# Altium project SIBB.PrjPcb
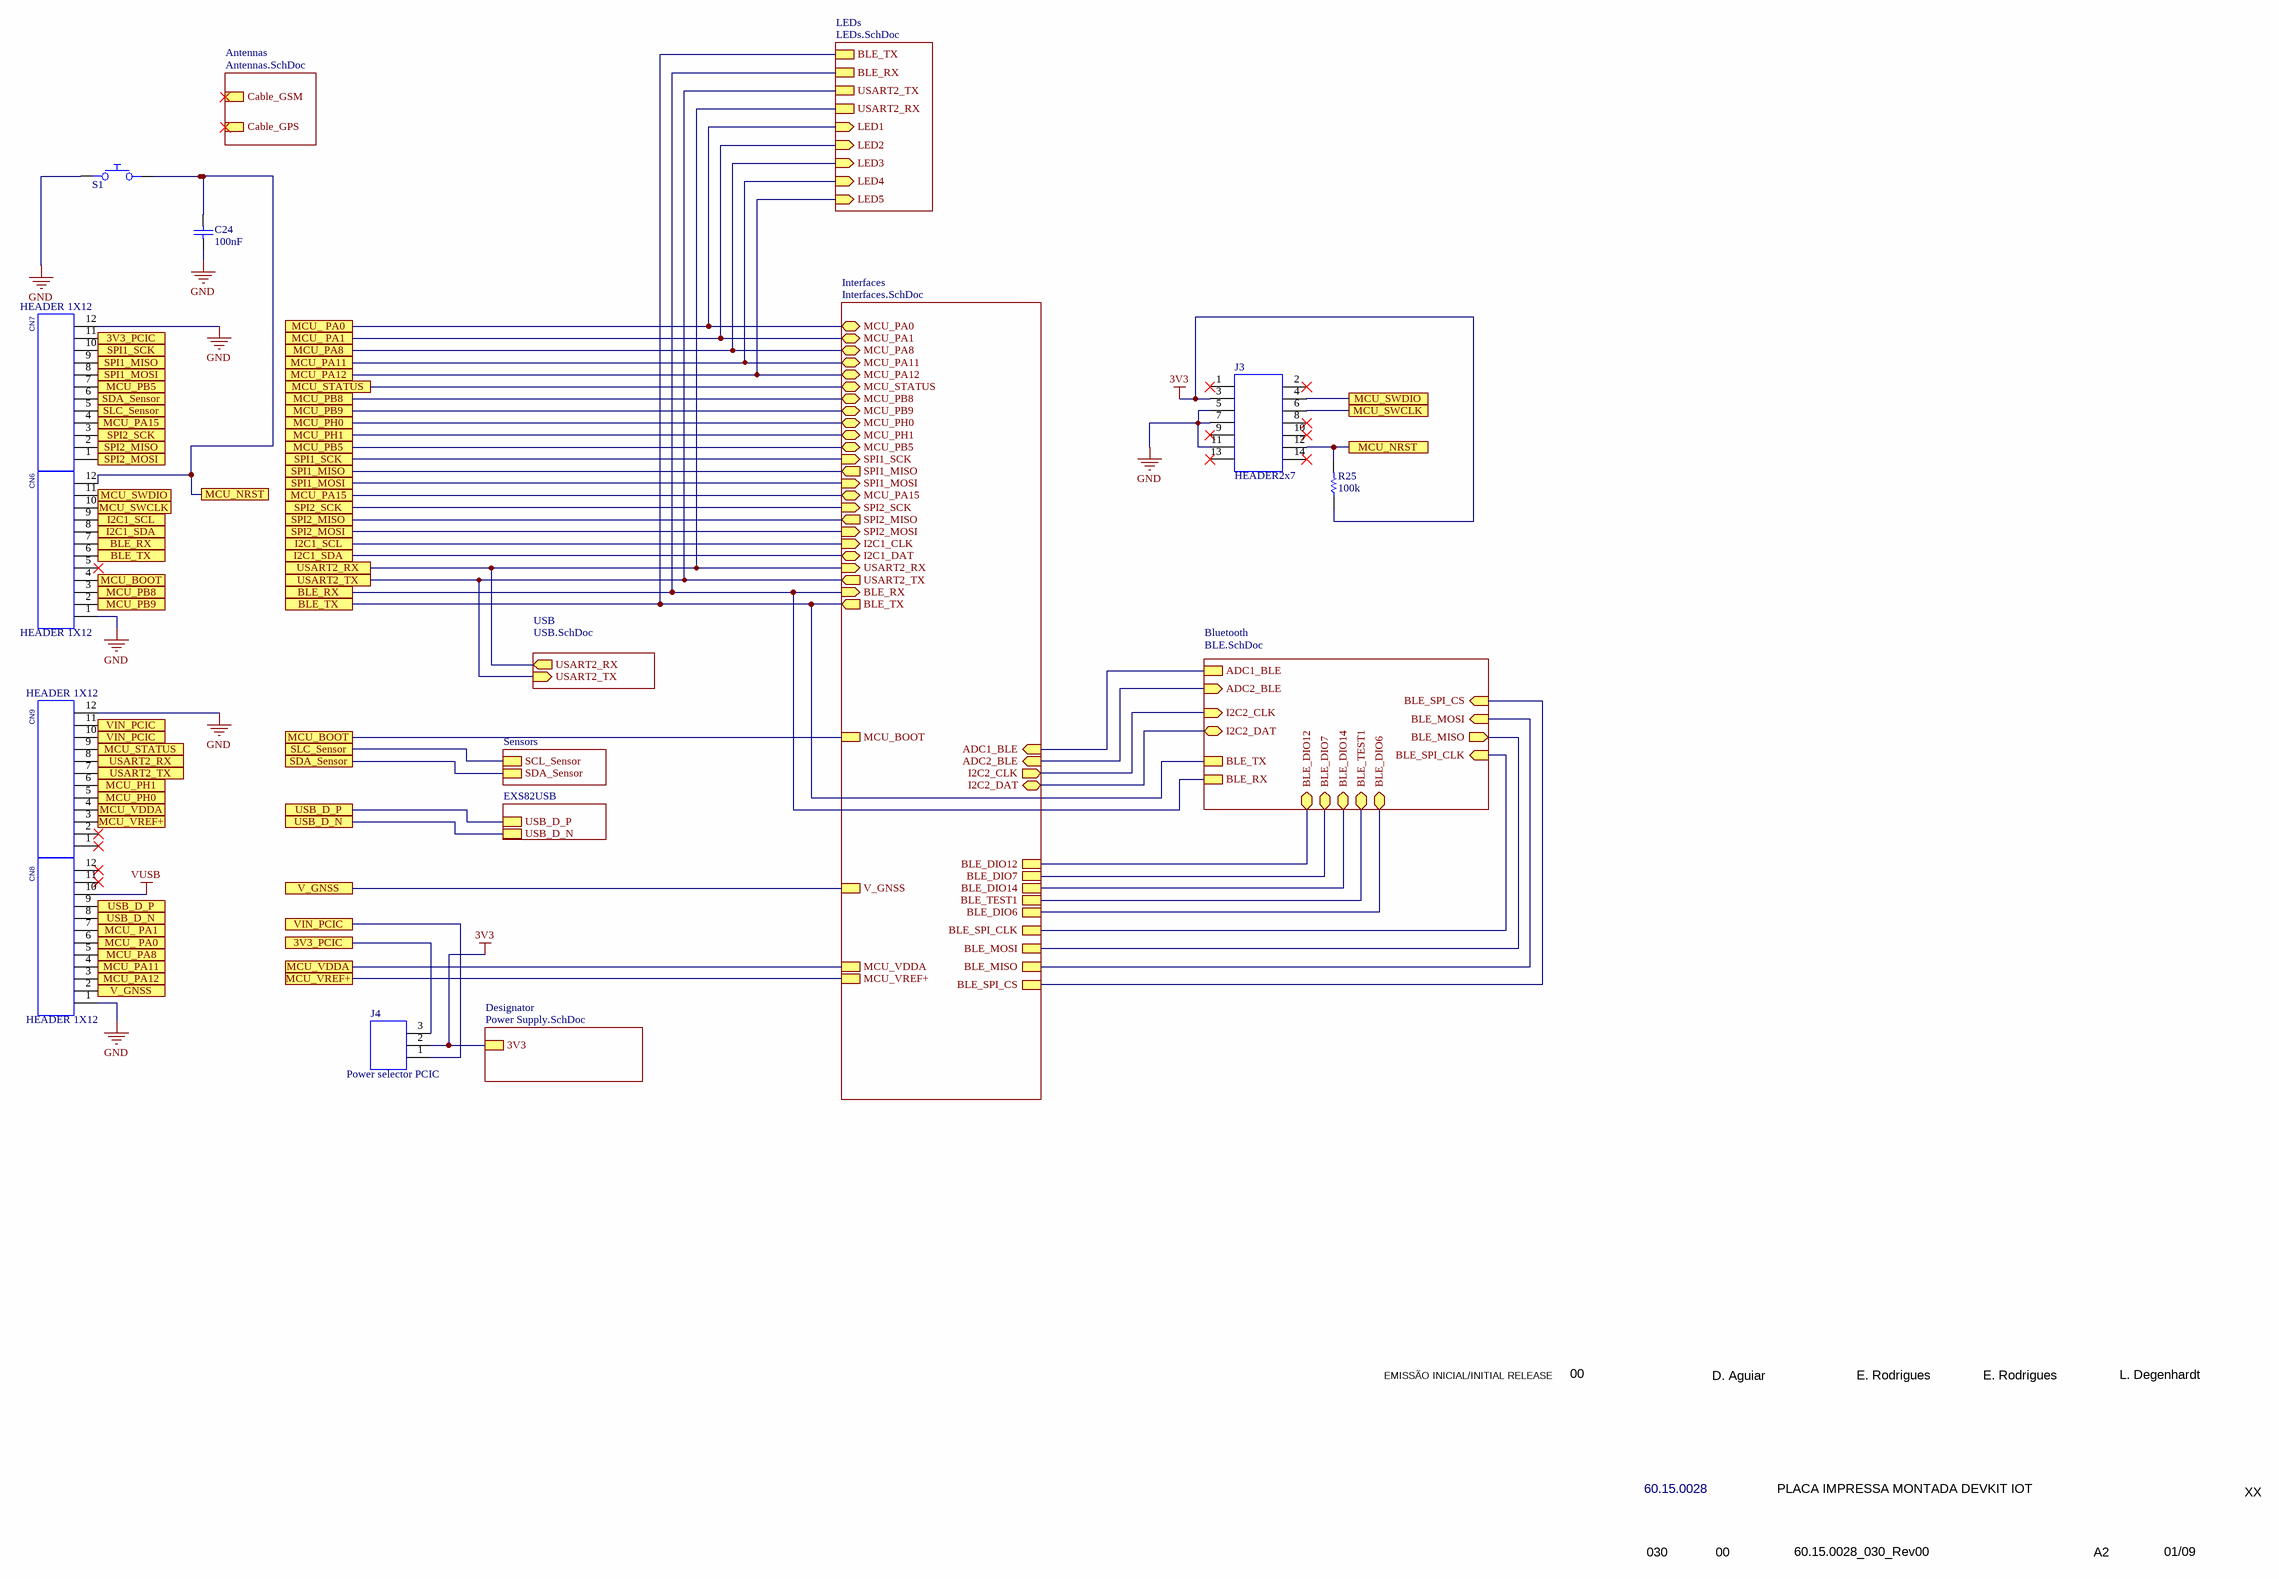
[diagram p0: Main.SchDoc]
9 sheets, 109 parts. Net scope: hierarchical (ports join the sheet entries above them; power ports are global).
Board file: 58.13.0094_400_Rev00.PcbDoc
Sheets:
  Main.SchDoc
    Antennas = Antennas.SchDoc
    Sensors = Sensors.SchDoc
    LEDs = LEDs.SchDoc
    USB = USB.SchDoc
    EXS82USB = EXS82_USB.SchDoc
    Designator = Power Supply.SchDoc
    Interfaces = Interfaces.SchDoc
    Bluetooth = BLE.SchDoc

## Sheet Main.SchDoc
size 594 x 420 mm; SheetNumber: 1; Organization: Altium Limited; Address1: L3, 12a Rodborough Rd; Address2: Frenchs Forest; Address3: NSW; Address4: Australia 2086; PageSetup: Record=PageOptions|CenterHorizontal=False|CenterVertical=False|PrintScale=0.43|XCorrection=0.00|YCorrection=0.00|PrintKind=1|BorderSize=5000000|LeftOffset=0|BottomOffset=0|Orientation=2|PaperLength=5940|PaperWidth=4200|Scale=100|PaperSource=7|PrintQuality=-4|MediaType=1|DitherType=10|PaperKind=Personal. 1: 215,9 x 279,4 mm|PrintScaleMode=0

### Parts
C24  Adicionado  [0201]  (value not drawn)
CN6  28.14.0552  [28.14.0552]  (value not drawn)
CN7  28.14.0552  [28.14.0552]  (value not drawn)
CN8  28.14.0552  [28.14.0552]  (value not drawn)
CN9  28.14.0552  [28.14.0552]  (value not drawn)
J3  value HEADER2x7  [70.11.0077]  (hidden comment: 70.11.0077)
J4  70.11.0083  [70.11.0083]  (value not drawn)
R25  value 100k  [0201]  (hidden comment: Adicionado)
S1  Adicionado  [PUSH_BUTTON]  (value not drawn)

### Sub-sheets
Antennas = Antennas.SchDoc: Cable_GSM, Cable_GPS
Bluetooth = BLE.SchDoc: ADC1_BLE, ADC2_BLE (in), I2C2_CLK (in), I2C2_DAT (bidir), BLE_TX, BLE_RX, BLE_SPI_CLK (in), BLE_MISO (out), BLE_MOSI (in), BLE_SPI_CS (in), BLE_DIO12 (bidir), BLE_DIO14 (bidir), BLE_DIO7 (bidir), BLE_DIO6 (bidir), BLE_TEST1 (bidir)
Designator = Power Supply.SchDoc: 3V3
EXS82USB = EXS82_USB.SchDoc: USB_D_P, USB_D_N
Interfaces = Interfaces.SchDoc: MCU_PB9 (bidir), MCU_PH0 (bidir), MCU_PH1 (bidir), MCU_PA0 (bidir), MCU_PA1 (bidir), MCU_PA8 (bidir), MCU_PA11 (bidir), MCU_PA12 (bidir), MCU_PA15 (bidir), SPI2_MOSI (in), SPI2_MISO (out), SPI2_SCK (in), I2C1_CLK (in), I2C1_DAT (bidir), SPI1_MOSI (in), SPI1_MISO (out), SPI1_SCK (in), USART2_RX (in), USART2_TX (out), BLE_TX (out), BLE_RX (in), ADC1_BLE (in), ADC2_BLE (in), MCU_PB5 (bidir), MCU_PB8 (bidir), BLE_DIO6, BLE_DIO7, BLE_DIO12, BLE_DIO14, BLE_TEST1, BLE_SPI_CS, BLE_SPI_CLK, BLE_MOSI, BLE_MISO, MCU_STATUS (bidir), MCU_BOOT, MCU_VDDA, MCU_VREF+, I2C2_CLK (out), I2C2_DAT (bidir), V_GNSS
LEDs = LEDs.SchDoc: LED1 (in), LED2 (in), LED3 (in), LED4 (in), LED5 (in), USART2_RX, USART2_TX, BLE_RX, BLE_TX
Sensors = Sensors.SchDoc: SCL_Sensor, SDA_Sensor
USB = USB.SchDoc: USART2_RX (out), USART2_TX (in)

### Ports
3V3_PCIC, BLE_RX, BLE_TX, I2C1_SCL, I2C1_SDA, MCU_ PA0, MCU_ PA1, MCU_BOOT, MCU_NRST, MCU_PA8, MCU_PA11, MCU_PA12, MCU_PA15, MCU_PB5, MCU_PB8, MCU_PB9, MCU_PH0, MCU_PH1, MCU_STATUS, MCU_SWCLK, MCU_SWDIO, MCU_VDDA, MCU_VREF+, SDA_Sensor, SLC_Sensor, SPI1_MISO, SPI1_MOSI, SPI1_SCK, SPI2_MISO, SPI2_MOSI, SPI2_SCK, USART2_RX, USART2_TX, USB_D_N, USB_D_P, V_GNSS, VIN_PCIC

### Nets
3V3: J3.3 J4.2 R25.1 ; sheet Designator/3V3
GND: C24.1 CN6.1 CN7.12 CN8.1 CN9.12 J3.5 J3.7 J3.11 S1.1
SCL_Sensor: CN7.5 ; port SLC_Sensor, sheet Sensors/SCL_Sensor
SDA_Sensor: CN7.6 ; port SDA_Sensor, sheet Sensors/SDA_Sensor
VUSB: CN8.10
3V3_PCIC: CN7.11 J4.3 ; port 3V3_PCIC
ADC1_BLE: sheet Interfaces/ADC1_BLE, sheet Bluetooth/ADC1_BLE
ADC2_BLE: sheet Interfaces/ADC2_BLE, sheet Bluetooth/ADC2_BLE
BLE_DIO6: sheet Interfaces/BLE_DIO6, sheet Bluetooth/BLE_DIO6
BLE_DIO7: sheet Interfaces/BLE_DIO7, sheet Bluetooth/BLE_DIO7
BLE_DIO12: sheet Interfaces/BLE_DIO12, sheet Bluetooth/BLE_DIO12
BLE_DIO14: sheet Interfaces/BLE_DIO14, sheet Bluetooth/BLE_DIO14
BLE_MISO: sheet Interfaces/BLE_MOSI, sheet Bluetooth/BLE_MISO
BLE_MOSI: sheet Interfaces/BLE_MISO, sheet Bluetooth/BLE_MOSI
BLE_RX: CN6.7 ; port BLE_RX, sheet LEDs/BLE_RX, sheet Interfaces/BLE_RX, sheet Bluetooth/BLE_RX
BLE_SPI_CLK: sheet Interfaces/BLE_SPI_CLK, sheet Bluetooth/BLE_SPI_CLK
BLE_SPI_CS: sheet Interfaces/BLE_SPI_CS, sheet Bluetooth/BLE_SPI_CS
BLE_TEST1: sheet Interfaces/BLE_TEST1, sheet Bluetooth/BLE_TEST1
BLE_TX: CN6.6 ; port BLE_TX, sheet LEDs/BLE_TX, sheet Interfaces/BLE_TX, sheet Bluetooth/BLE_TX
I2C1_CLK: CN6.9 ; port I2C1_SCL, sheet Interfaces/I2C1_CLK
I2C1_DAT: CN6.8 ; port I2C1_SDA, sheet Interfaces/I2C1_DAT
I2C2_CLK: sheet Interfaces/I2C2_CLK, sheet Bluetooth/I2C2_CLK
I2C2_DAT: sheet Interfaces/I2C2_DAT, sheet Bluetooth/I2C2_DAT
LED1: CN8.6 ; port MCU_ PA0, sheet LEDs/LED1, sheet Interfaces/MCU_PA0
LED2: CN8.7 ; port MCU_ PA1, sheet LEDs/LED2, sheet Interfaces/MCU_PA1
LED3: CN8.5 ; port MCU_PA8, sheet LEDs/LED3, sheet Interfaces/MCU_PA8
LED4: CN8.4 ; port MCU_PA11, sheet LEDs/LED4, sheet Interfaces/MCU_PA11
LED5: CN8.3 ; port MCU_PA12, sheet LEDs/LED5, sheet Interfaces/MCU_PA12
MCU_BOOT: CN6.4 ; port MCU_BOOT, sheet Interfaces/MCU_BOOT
MCU_NRST: C24.2 CN6.12 J3.12 R25.2 S1.2 ; port MCU_NRST
MCU_PA15: CN7.4 ; port MCU_PA15, sheet Interfaces/MCU_PA15
MCU_PB5: CN7.7 ; port MCU_PB5, sheet Interfaces/MCU_PB5
MCU_PB8: CN6.3 ; port MCU_PB8, sheet Interfaces/MCU_PB8
MCU_PB9: CN6.2 ; port MCU_PB9, sheet Interfaces/MCU_PB9
MCU_PH0: CN9.5 ; port MCU_PH0, sheet Interfaces/MCU_PH0
MCU_PH1: CN9.6 ; port MCU_PH1, sheet Interfaces/MCU_PH1
MCU_STATUS: CN9.9 ; port MCU_STATUS, sheet Interfaces/MCU_STATUS
MCU_SWCLK: CN6.10 J3.6 ; port MCU_SWCLK
MCU_SWDIO: CN6.11 J3.4 ; port MCU_SWDIO
MCU_VDDA: CN9.4 ; port MCU_VDDA, sheet Interfaces/MCU_VDDA
MCU_VREF+: CN9.3 ; port MCU_VREF+, sheet Interfaces/MCU_VREF+
SPI1_MISO: CN7.9 ; port SPI1_MISO, sheet Interfaces/SPI1_MISO
SPI1_MOSI: CN7.8 ; port SPI1_MOSI, sheet Interfaces/SPI1_MOSI
SPI1_SCK: CN7.10 ; port SPI1_SCK, sheet Interfaces/SPI1_SCK
SPI2_MISO: CN7.2 ; port SPI2_MISO, sheet Interfaces/SPI2_MISO
SPI2_MOSI: CN7.1 ; port SPI2_MOSI, sheet Interfaces/SPI2_MOSI
SPI2_SCK: CN7.3 ; port SPI2_SCK, sheet Interfaces/SPI2_SCK
USART2_RX: CN9.8 ; port USART2_RX, sheet LEDs/USART2_RX, sheet USB/USART2_RX, sheet Interfaces/USART2_RX
USART2_TX: CN9.7 ; port USART2_TX, sheet LEDs/USART2_TX, sheet USB/USART2_TX, sheet Interfaces/USART2_TX
USB_D_N: CN8.8 ; port USB_D_N, sheet EXS82USB/USB_D_N
USB_D_P: CN8.9 ; port USB_D_P, sheet EXS82USB/USB_D_P
V_GNSS: CN8.2 ; port V_GNSS, sheet Interfaces/V_GNSS
VIN_PCIC: CN9.10 CN9.11 J4.1 ; port VIN_PCIC

Not connected (* = marked no-connect by the designer): CN6 5*; CN8 11* 12*; CN9 1* 2*; J3 1* 2* 8* 9* 10* 13* 14*

### Notes on the sheet
- (near J4) Power selector PCIC
- EMISSÃO INICIAL/INITIAL RELEASE
- 00
- D. Aguiar
- E. Rodrigues
- L. Degenhardt
- 60.15.0028
- PLACA IMPRESSA MONTADA DEVKIT IOT
- XX
- 030
- 60.15.0028_030_Rev00
- A2
- 01/09
- 1
- 2
- 3
- 4
- 5
- 6
- 7
- 8
- A
- B
- C
- D
- E
- F
- G
- H
- HISTORICO DA REV / EVOLUTION
- REV
- DATA / DATE
- DOCUMENTO DE ENGENHARIA DE PRODUTO
- ELABORADO / DRAWN
- DOCUMENT OF PRODUCT ENGINEERING
- VERIFICADO / CHECKED
- APROVADO / APPROVED
- QUALIDADE / QUALITY
- CÓDIGO / CODE
- DESCRIÇÃO / DESCRIPTION
- DOC
- ARQUIVO / FILE
- FORM./SIZE
- FOLHA / PAGE
- (in symbol 28.14.0552) HEADER 1X12
- (in symbol 0201X104J100CT) 100nF

### Library data of the parts
C24 = 0201X104J100CT: CAPACITOR CERAMICO 100nF 10V 5% X5R SMD 0201
CN6-CN9 = 28.14.0552: CONECTOR HEADER FM 12 VIAS 180G P/PCB
J3 = 70.11.0077: BARRA PINOS 2X7 1,27mm VERTICAL MACHO; Part Number: 67997-428HLF; Manufactor: AMPHENOL FCI
J4 = 70.11.0083: BARRA TERMINAIS 180G 1X3 POSICOES 2,54MM
R25 = RC0201FR-07100KL: RESISTOR THICK FILM 100k OHMS 25V 50mW 1% SMD 0201
S1 = Push Button: TACTILE SWITCH SPST 0.05A 12VDC SMD; Manufacturer: C&K Switches; Part Number: PTS540JK035SMTRLFS; Voltage Rating (DC): 12V; Current Rating: 50mA; Switch Function: Off-On; Operating Force: 230gf; Library Control - Checked Footprint: Yes; Library Control - Person that Checked Schematic: Nícolas; Bounce time (MAX): 10ms; ComponentLink1Description: Datasheet; ComponentLink1URL: https://www.mouser.com/datasheet/2/60/pts540-1841856.pdf; ComponentLink2Description: Mouser Link; ComponentLink2URL: https://www.mouser.com/ProductDetail/CK/PTS540JK035SMTRLFS?qs=nsc5Ve2%252BdoHscnqTjIh87g%3D%3D; Supplier 1: Mouser; Category: Tactile Switches; Pricing 1: 1=0,18, 10=0,174, 100=0,15, 500=0,122, 1000=0,103 (USD); Throw Configuration: SPST; Orientation: Straight; Supplier Part Number 1: 611-PTS540JK035SMTRL; Library Ref: Diversos; Library Control - Checked Schematic: Yes; Library Control - Person that Checked Footprint: Nícolas; Library Control - Person that did the Last Update Schematic: Nícolas

## Sheet Antennas.SchDoc
size 594 x 420 mm; SheetNumber: 3; PageSetup: Record=PageOptions|CenterHorizontal=False|CenterVertical=False|PrintScale=0.43|XCorrection=0.00|YCorrection=0.00|PrintKind=1|BorderSize=5000000|LeftOffset=0|BottomOffset=0|Orientation=2|PaperLength=5940|PaperWidth=4200|Scale=100|PaperSource=7|PrintQuality=-4|MediaType=1|DitherType=10|PaperKind=Personal. 1: 215,9 x 279,4 mm|PrintScaleMode=0
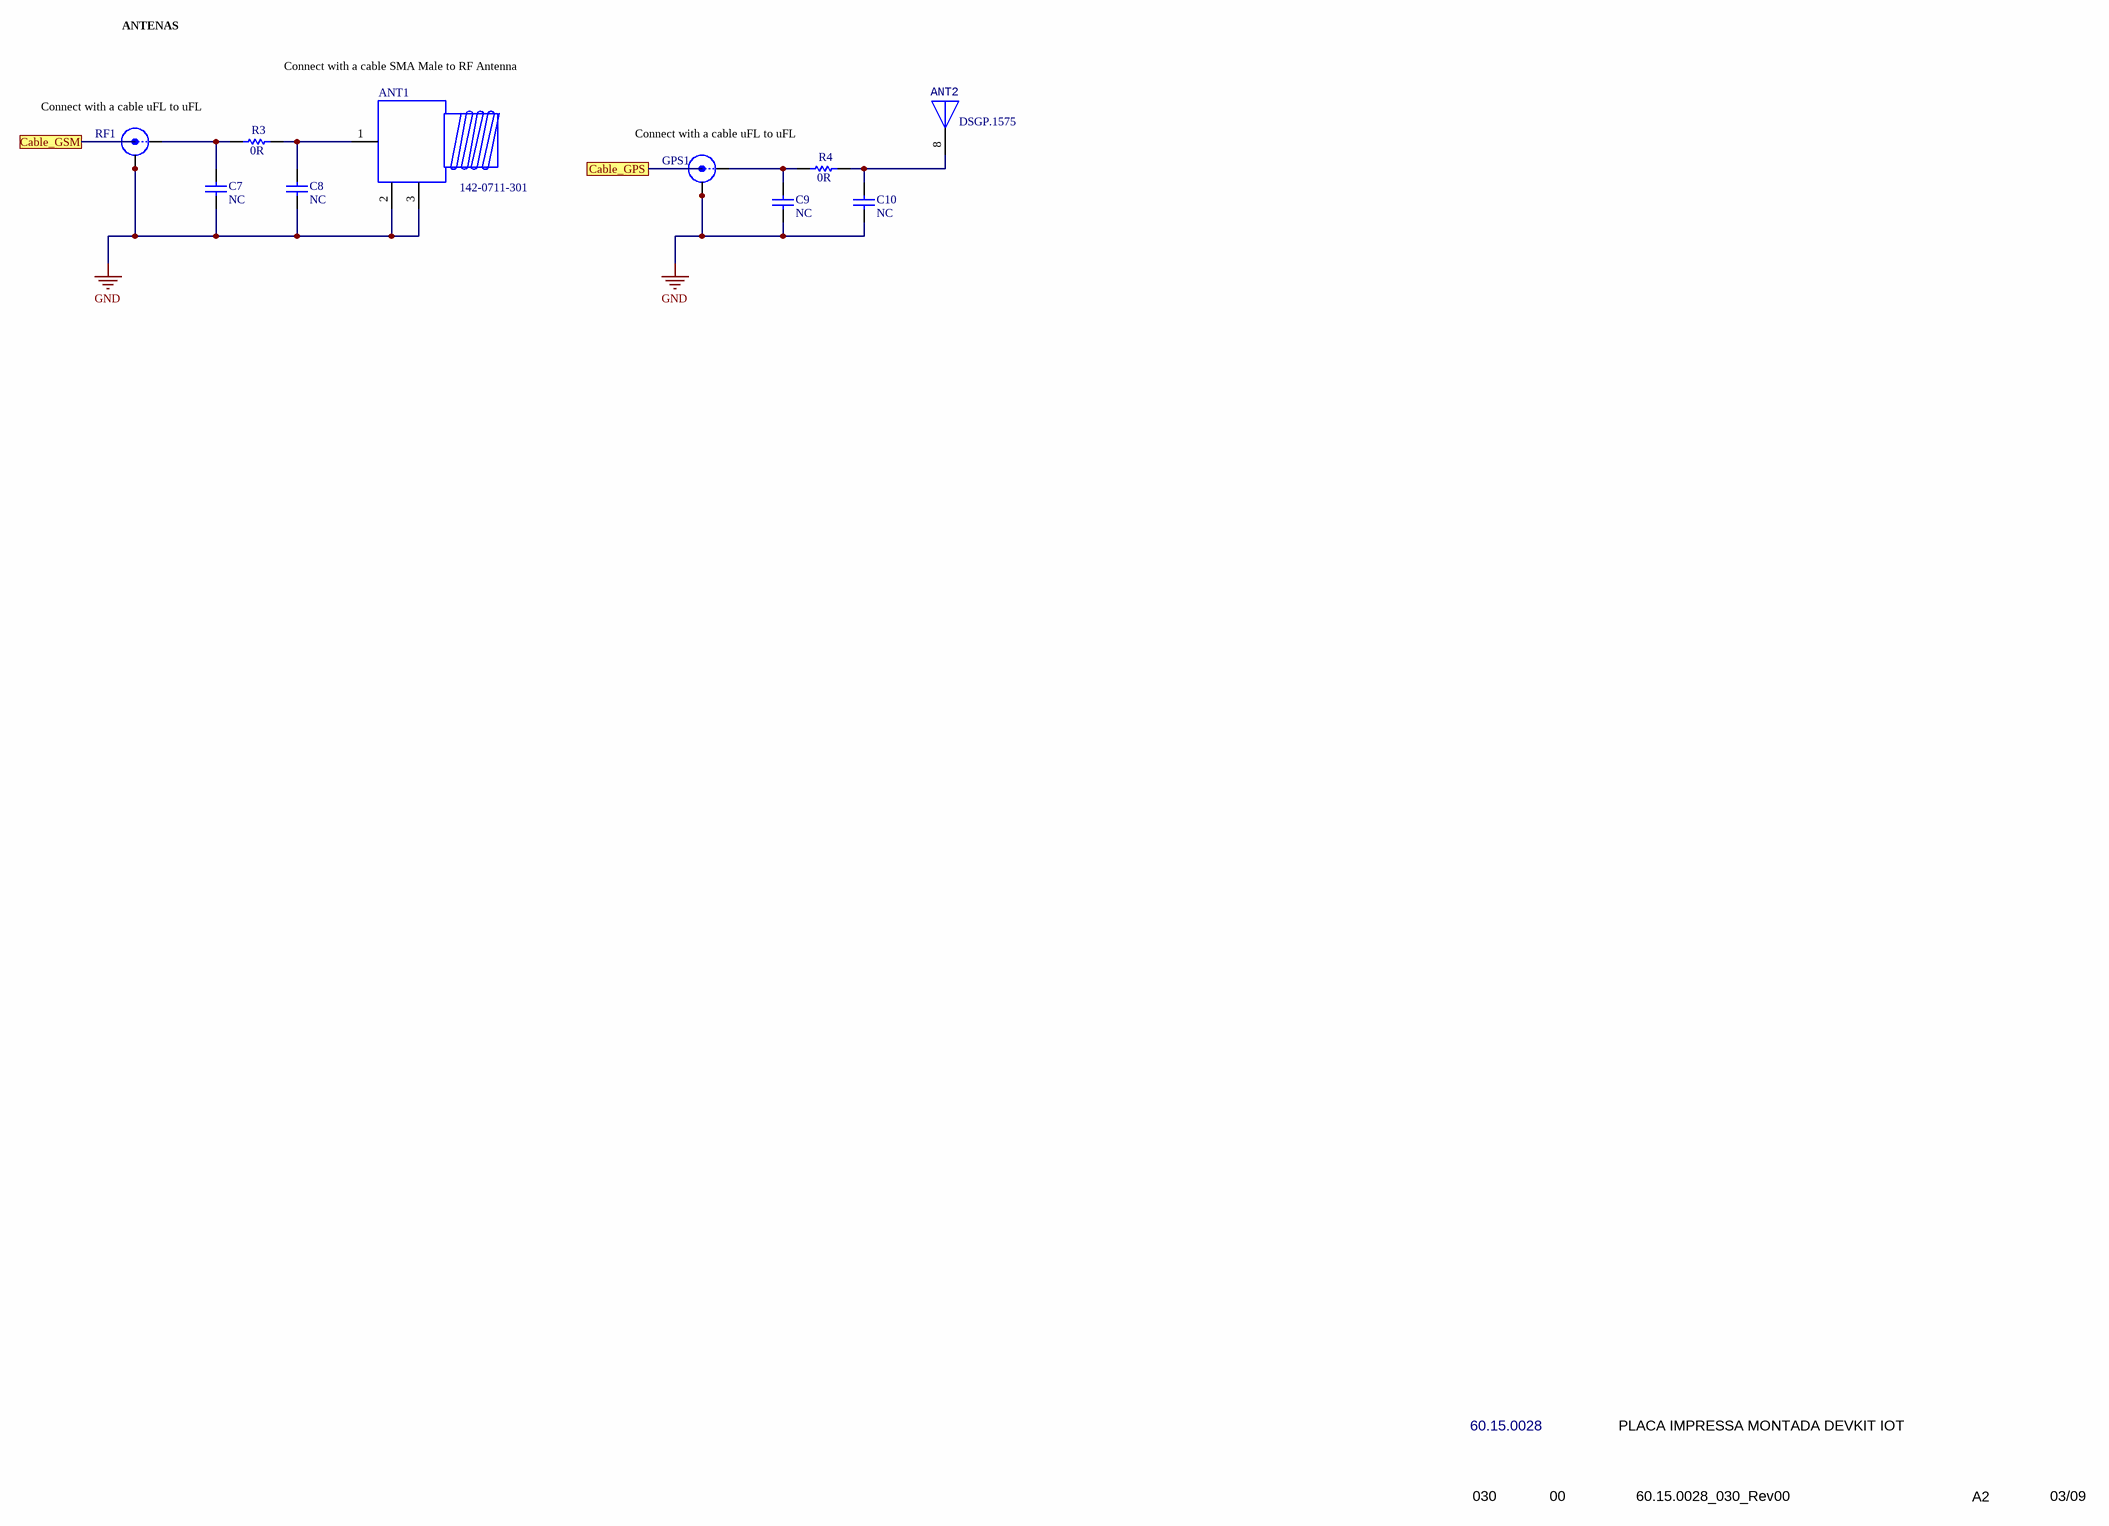
[diagram p1: Antennas.SchDoc]

### Parts
ANT1  value 142-0711-301  [28.21.0036]  (hidden comment: 28.21.0036)
ANT2  50.42.0045  [50.42.0045]  (value not drawn)
C7  value NC  [0603-CAP-NA]  (hidden comment: 0603-CAP-NA)
C8  value NC  [0603-CAP-NA]  (hidden comment: 0603-CAP-NA)
C9  value NC  [0603-CAP-NA]  (hidden comment: 0603-CAP-NA)
C10  value NC  [0603-CAP-NA]  (hidden comment: 0603-CAP-NA)
GPS1  28.20.0019  [28.20.0019]  (value not drawn)
R3  value 0R  [66.24.1337]  (hidden comment: 66.24.1337)
R4  value 0R  [66.24.1337]  (hidden comment: 66.24.1337)
RF1  28.20.0019  [28.20.0019]  (value not drawn)

### Ports
Cable_GPS, Cable_GSM

### Nets
GND: ANT1.2 ANT1.3 C7.1 C8.1 C9.1 C10.1 GPS1.2(GND) GPS1.3(GND) RF1.2(GND) RF1.3(GND)
NetANT1_1: ANT1.1 C8.2 R3.2
NetANT2_8: ANT2.8 C10.2 R4.2
NetC7_2: C7.2 R3.1 RF1.1(SIG)
NetC9_2: C9.2 GPS1.1(SIG) R4.1

### Notes on the sheet
- ANTENAS
- Connect with a cable SMA Male to RF Antenna
- Connect with a cable uFL to uFL
- 60.15.0028
- PLACA IMPRESSA MONTADA DEVKIT IOT
- 030
- 00
- 60.15.0028_030_Rev00
- A2
- 03/09
- 1
- 2
- 3
- 4
- 5
- 6
- 7
- 8
- A
- B
- C
- D
- E
- F
- G
- H
- DOCUMENTO DE ENGENHARIA DE PRODUTO
- DOCUMENT OF PRODUCT ENGINEERING
- CÓDIGO / CODE
- DESCRIÇÃO / DESCRIPTION
- DOC
- REV
- ARQUIVO / FILE
- FORM./SIZE
- FOLHA / PAGE
- (in symbol 50.42.0045) DSGP.1575

### Library data of the parts
ANT1 = 28.21.0036: CONECTOR SMA JACK R/A 50 OHM SMD
ANT2 = 50.42.0045: ANTENA CERAMICA SMT PARA GPSL1
C7-C10 = 0603-CAP-NA: CAPACITOR ABERTO
GPS1 RF1 = 28.20.0019: CONECTOR MICRO COAXIAL 50 OHM SMD
R3 R4 = 66.24.1337: RESISTOR THICK FILM 0,1W 0 OHMS SMD 0603

## Sheet Sensors.SchDoc
size 594 x 420 mm; SheetNumber: 4; PageSetup: Record=PageOptions|CenterHorizontal=False|CenterVertical=False|PrintScale=0.43|XCorrection=0.00|YCorrection=0.00|PrintKind=1|BorderSize=5000000|LeftOffset=0|BottomOffset=0|Orientation=2|PaperLength=5940|PaperWidth=4200|Scale=100|PaperSource=7|PrintQuality=-4|MediaType=1|DitherType=10|PaperKind=Personal. 1: 215,9 x 279,4 mm|PrintScaleMode=0
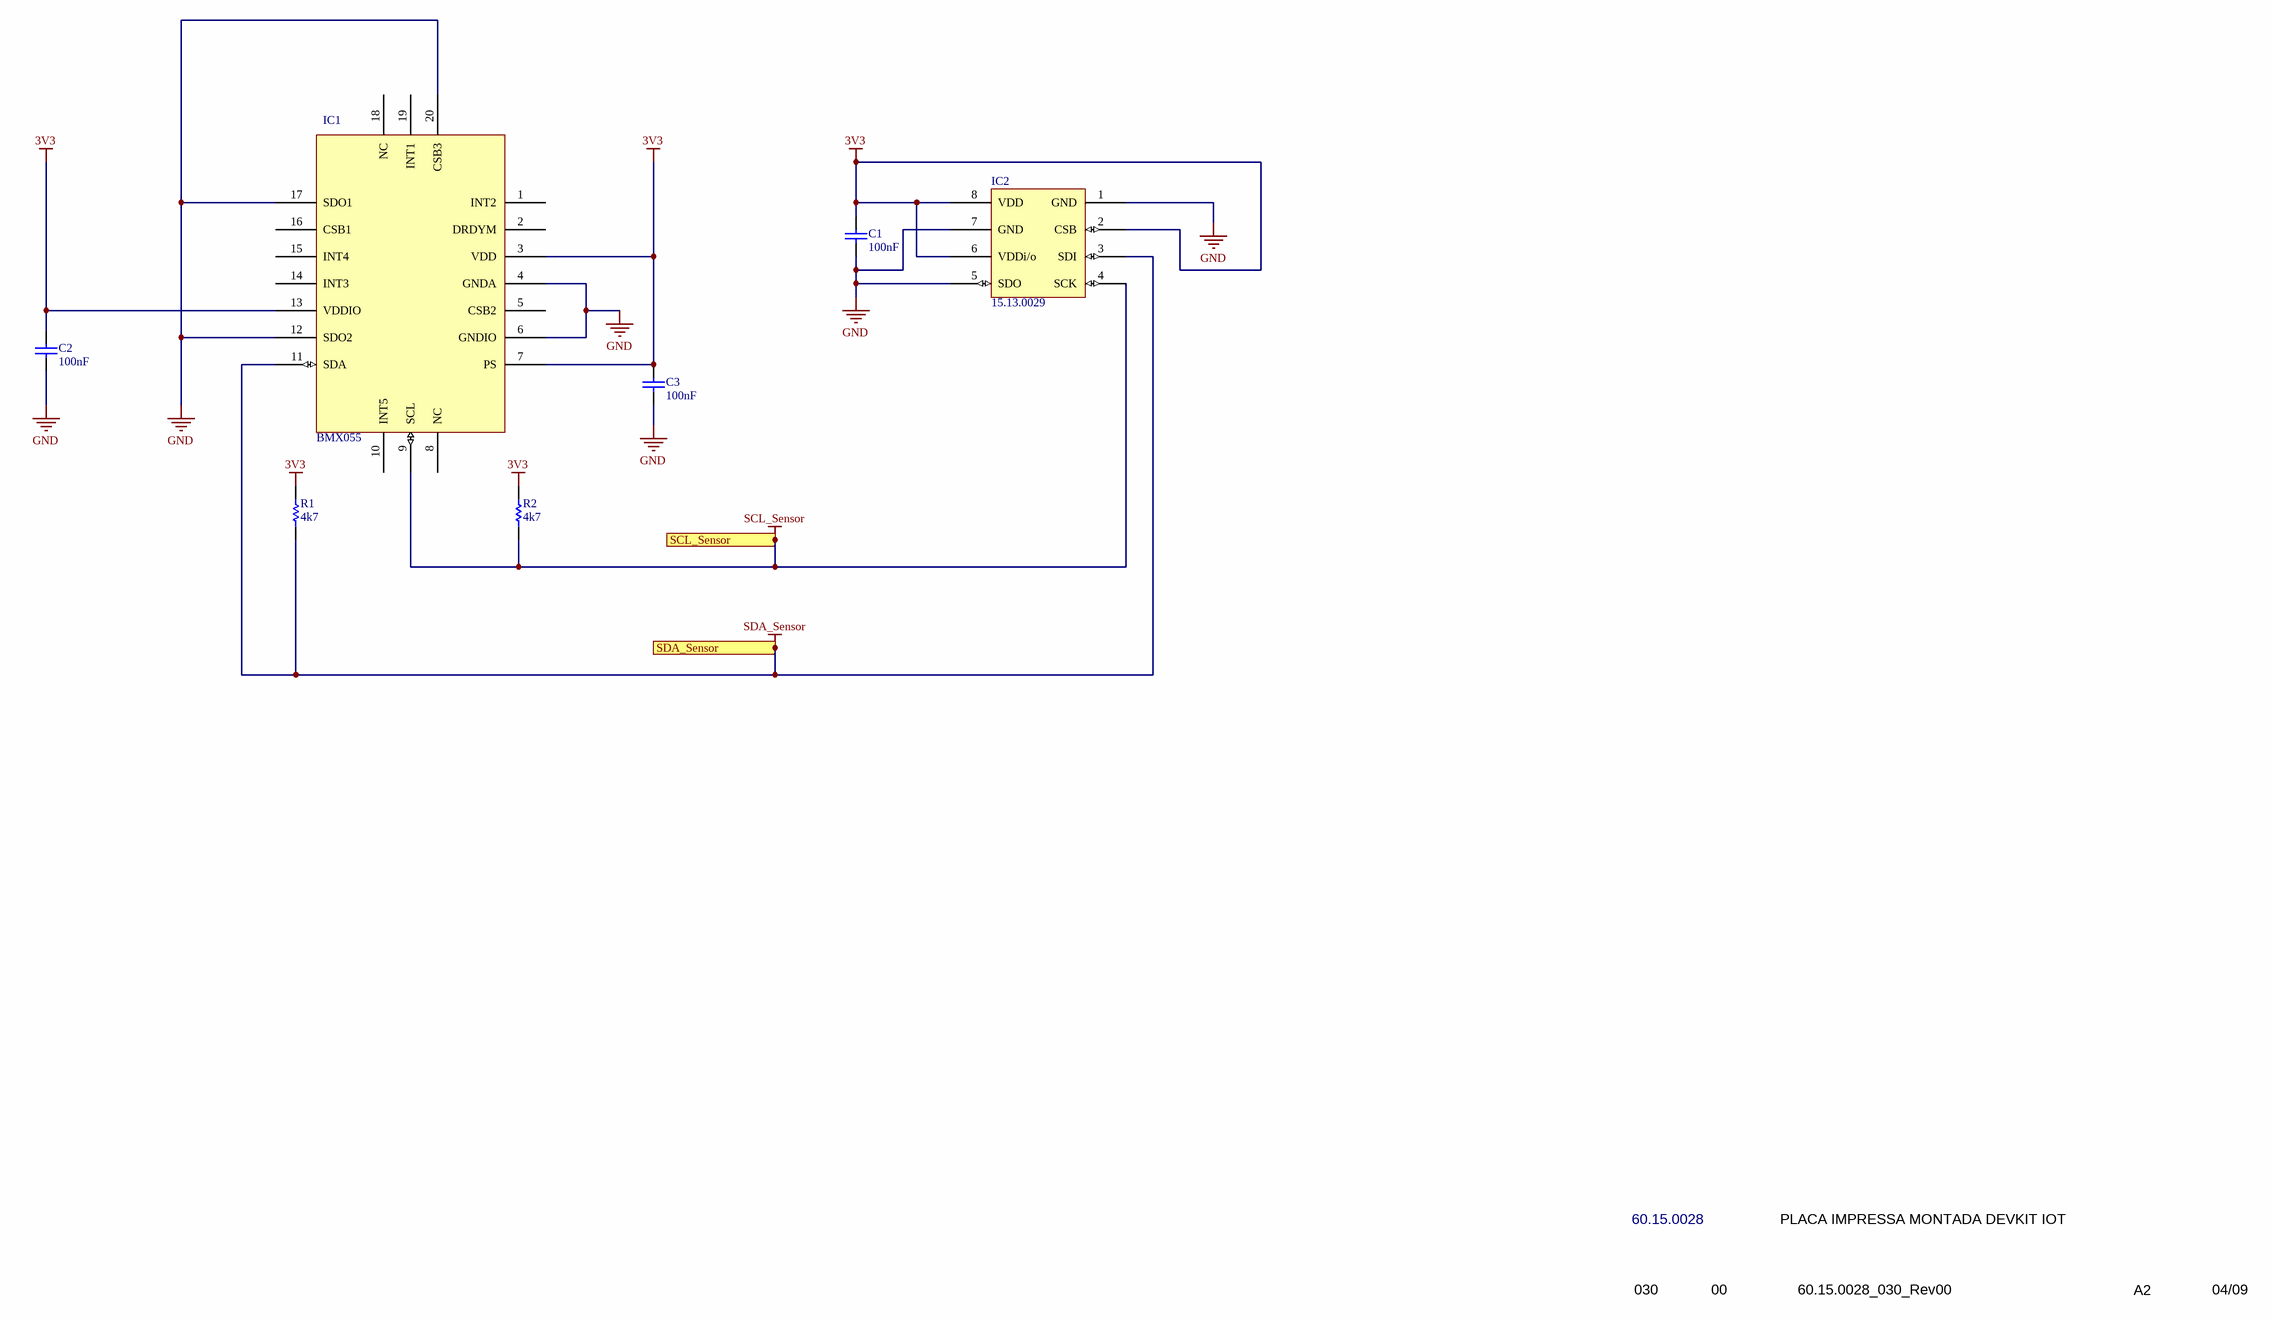
[diagram p2: Sensors.SchDoc]

### Parts
C1  16.23.0333  [16.23.0333]  (value not drawn)
C2  16.23.0333  [16.23.0333]  (value not drawn)
C3  16.23.0333  [16.23.0333]  (value not drawn)
IC1  BMX055  [15.15.0010]
IC2  15.13.0029  [15.13.0029]
R1  value 4k7  [66.24.0659]  (hidden comment: 66.24.0659)
R2  value 4k7  [66.24.0659]  (hidden comment: 66.24.0659)

### Ports
SCL_Sensor, SDA_Sensor

### Nets
3V3: C1.2 C2.2 C3.2 IC1.3(VDD) IC1.7(PS) IC1.13(VDDIO) IC2.2(CSB) IC2.6(VDDi/o) IC2.8(VDD) R1.1 R2.1
GND: C1.1 C2.1 C3.1 IC1.4(GNDA) IC1.6(GNDIO) IC1.12(SDO2) IC1.17(SDO1) IC1.20(CSB3) IC2.1(GND) IC2.5(SDO) IC2.7(GND)
SCL_Sensor: IC1.9(SCL) IC2.4(SCK) R2.2 ; port SCL_Sensor
SDA_Sensor: IC1.11(SDA) IC2.3(SDI) R1.2 ; port SDA_Sensor

Not connected (* = marked no-connect by the designer): IC1 1(INT2) 2(DRDYM) 5(CSB2) 8(NC) 10(INT5) 14(INT3) 15(INT4) 16(CSB1) 18(NC) 19(INT1)

### Notes on the sheet
- 60.15.0028
- PLACA IMPRESSA MONTADA DEVKIT IOT
- 030
- 00
- 60.15.0028_030_Rev00
- A2
- 04/09
- 1
- 2
- 3
- 4
- 5
- 6
- 7
- 8
- A
- B
- C
- D
- E
- F
- G
- H
- DOCUMENTO DE ENGENHARIA DE PRODUTO
- DOCUMENT OF PRODUCT ENGINEERING
- CÓDIGO / CODE
- DESCRIÇÃO / DESCRIPTION
- DOC
- REV
- ARQUIVO / FILE
- FORM./SIZE
- FOLHA / PAGE
- (in symbol 16.23.0333) 100nF

### Library data of the parts
C1-C3 = 16.23.0333: CC 100NF 16V X5R 0402 SMD
IC1 = 15.15.0010: SENSOR ACELEROMETRO MAGNETOMETRO E GIROSCOPIO - BMX055
IC2 = 15.13.0029: SENSOR DE TEMPERATURA UMIDADE E PRESSAO - BME280
R1 R2 = 66.24.0659: RES MET 0,1W 4,7K OHMS 1% 100 PPM 50 V SMD 0603 PBF

## Sheet LEDs.SchDoc
size 594 x 420 mm; SheetNumber: 9; PageSetup: Record=PageOptions|CenterHorizontal=False|CenterVertical=False|PrintScale=0.43|XCorrection=0.00|YCorrection=0.00|PrintKind=1|BorderSize=5000000|LeftOffset=0|BottomOffset=0|Orientation=2|PaperLength=5940|PaperWidth=4200|Scale=100|PaperSource=7|PrintQuality=-4|MediaType=1|DitherType=10|PaperKind=Personal. 1: 215,9 x 279,4 mm|PrintScaleMode=0
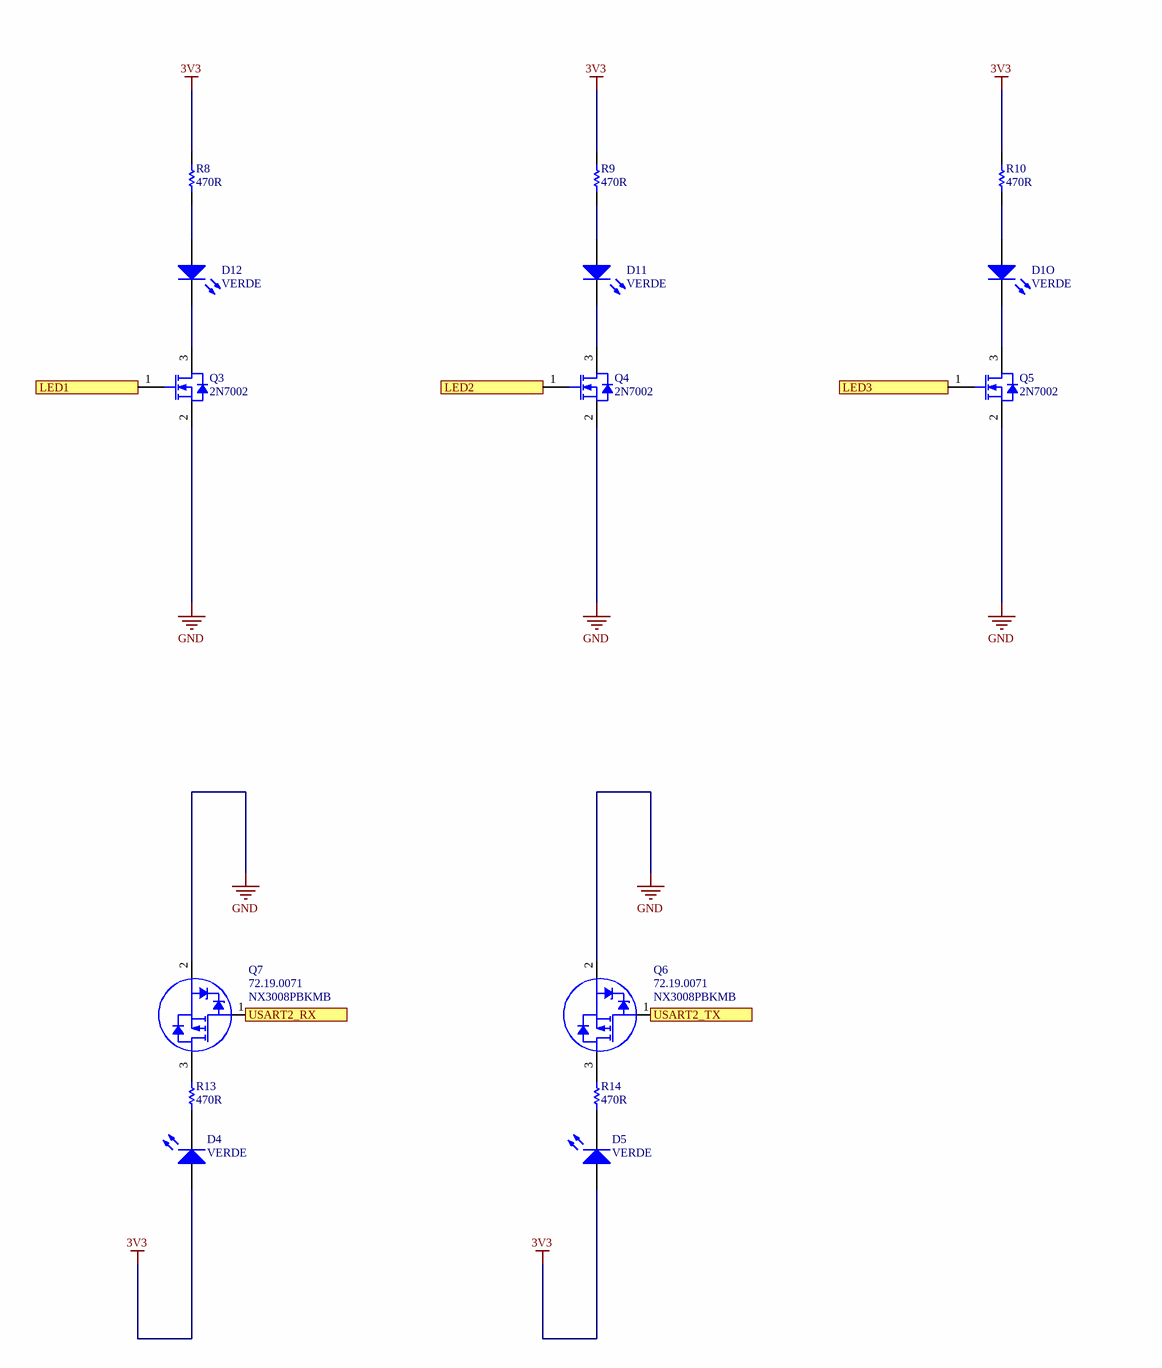
[diagram p3: LEDs.SchDoc, left]
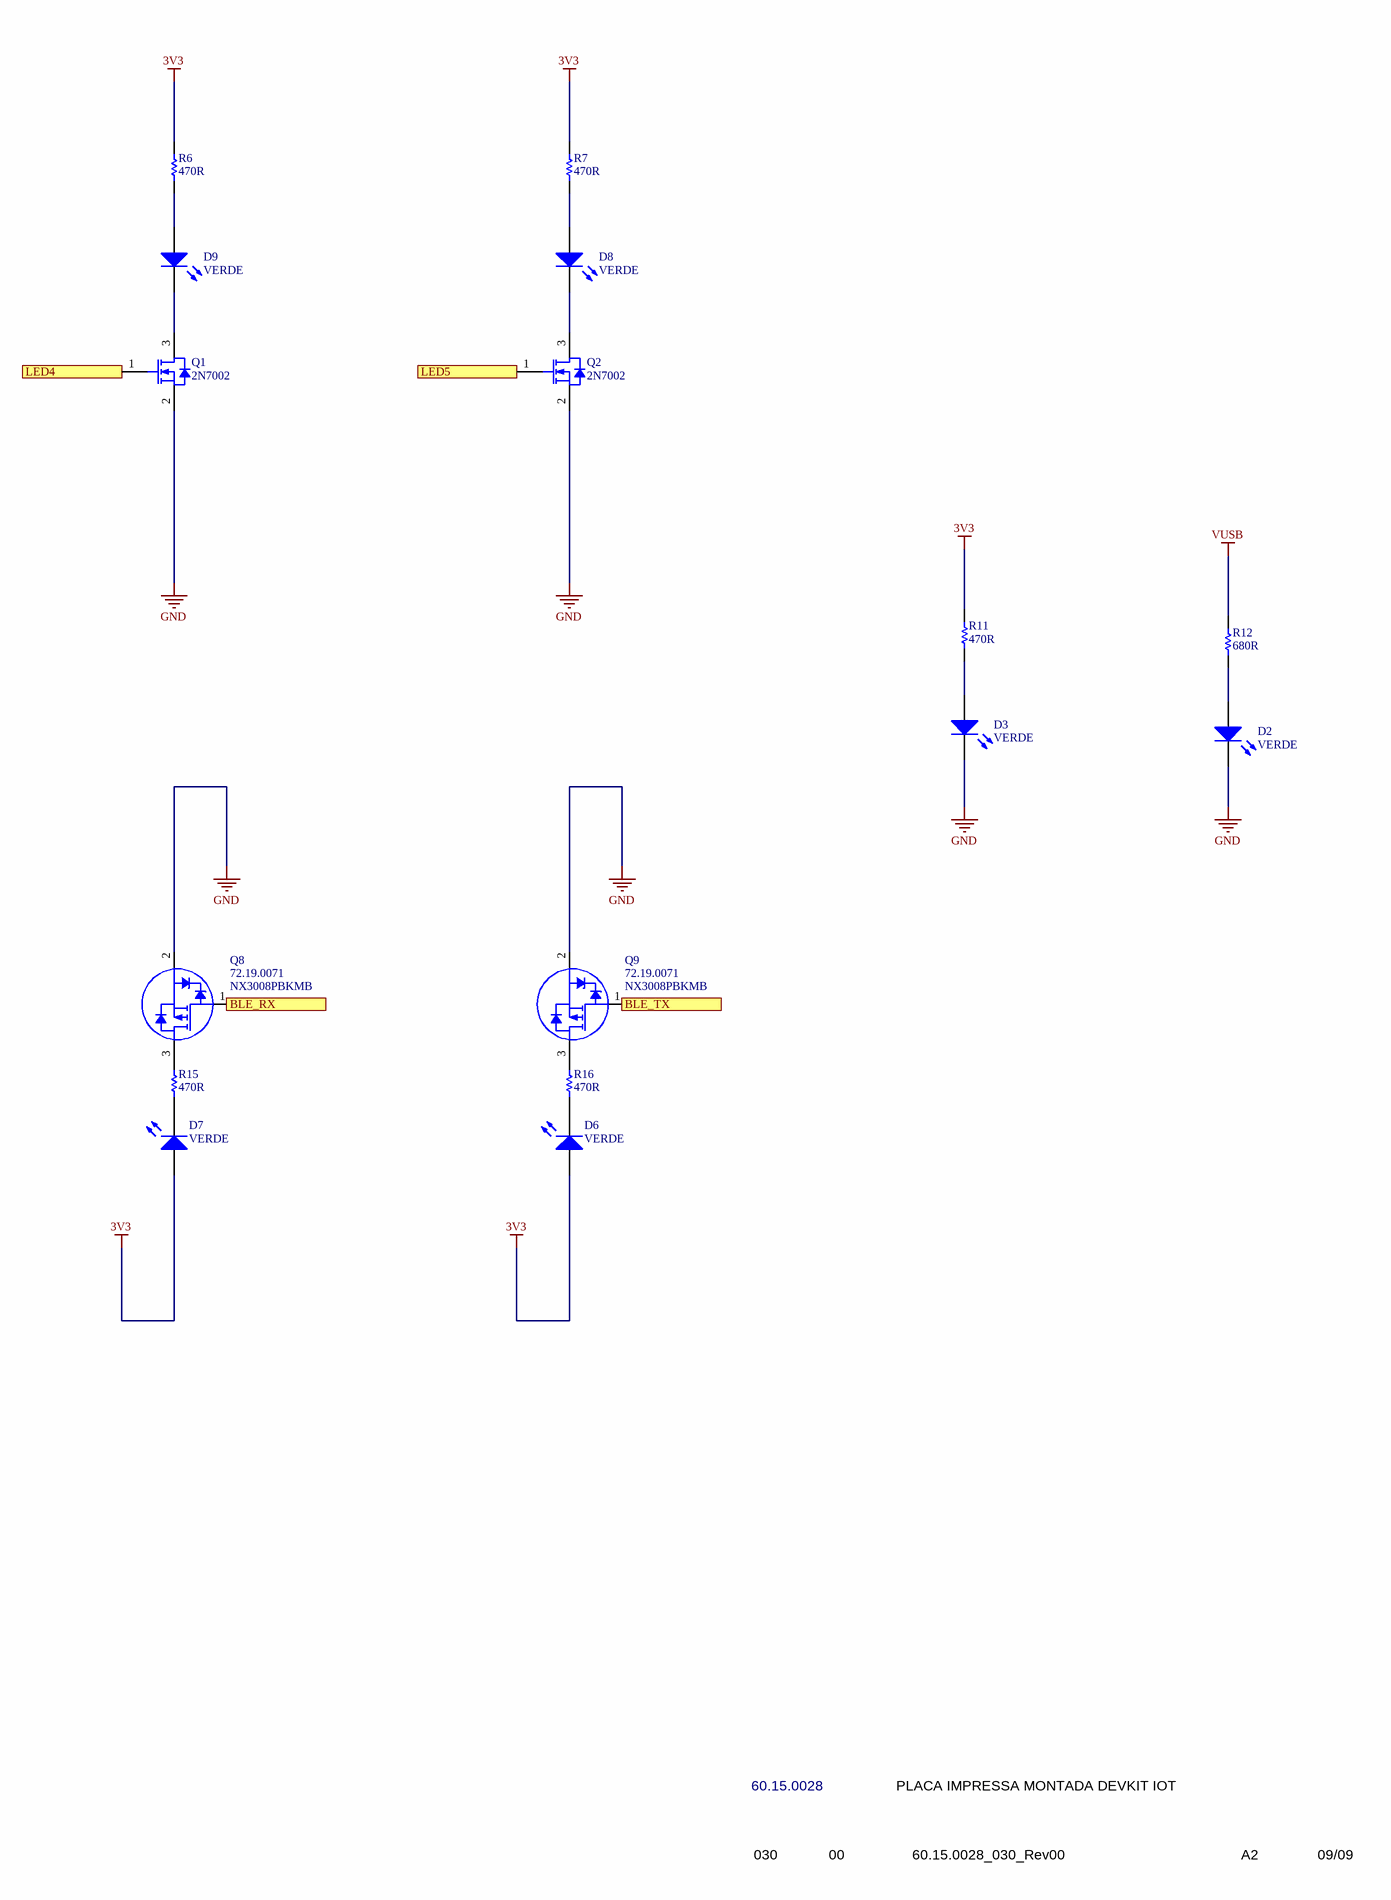
[diagram p4: LEDs.SchDoc, right]

### Parts
D1O  32.17.0022  [32.17.0022]  (value not drawn)
D2  32.17.0022  [32.17.0022]  (value not drawn)
D3  32.17.0022  [32.17.0022]  (value not drawn)
D4  32.17.0022  [32.17.0022]  (value not drawn)
D5  32.17.0022  [32.17.0022]  (value not drawn)
D6  32.17.0022  [32.17.0022]  (value not drawn)
D7  32.17.0022  [32.17.0022]  (value not drawn)
D8  32.17.0022  [32.17.0022]  (value not drawn)
D9  32.17.0022  [32.17.0022]  (value not drawn)
D11  32.17.0022  [32.17.0022]  (value not drawn)
D12  32.17.0022  [32.17.0022]  (value not drawn)
Q1  72.19.0021  [72.19.0021]  (value not drawn)
Q2  72.19.0021  [72.19.0021]  (value not drawn)
Q3  72.19.0021  [72.19.0021]  (value not drawn)
Q4  72.19.0021  [72.19.0021]  (value not drawn)
Q5  72.19.0021  [72.19.0021]  (value not drawn)
Q6  72.19.0071  [72.19.0071]
Q7  72.19.0071  [72.19.0071]
Q8  72.19.0071  [72.19.0071]
Q9  72.19.0071  [72.19.0071]
R6  value 470R  [66.33.4700]  (hidden comment: 66.33.4700)
R7  value 470R  [66.33.4700]  (hidden comment: 66.33.4700)
R8  value 470R  [66.33.4700]  (hidden comment: 66.33.4700)
R9  value 470R  [66.33.4700]  (hidden comment: 66.33.4700)
R10  value 470R  [66.33.4700]  (hidden comment: 66.33.4700)
R11  value 470R  [66.33.4700]  (hidden comment: 66.33.4700)
R12  value 680R  [66.33.6800]  (hidden comment: 66.33.6800)
R13  value 470R  [66.33.4700]  (hidden comment: 66.33.4700)
R14  value 470R  [66.33.4700]  (hidden comment: 66.33.4700)
R15  value 470R  [66.33.4700]  (hidden comment: 66.33.4700)
R16  value 470R  [66.33.4700]  (hidden comment: 66.33.4700)

### Ports
BLE_RX, BLE_TX, LED1, LED2, LED3, LED4, LED5, USART2_RX, USART2_TX

### Nets
3V3: D4.A D5.A D6.A D7.A R6.2 R7.2 R8.2 R9.2 R10.2 R11.2
GND: D2.K D3.K Q1.2(S) Q2.2(S) Q3.2(S) Q4.2(S) Q5.2(S) Q6.2(S) Q7.2(S) Q8.2(S) Q9.2(S)
VUSB: R12.2
BLE_RX: Q8.1(G) ; port BLE_RX
BLE_TX: Q9.1(G) ; port BLE_TX
LED1: Q3.1(G) ; port LED1
LED2: Q4.1(G) ; port LED2
LED3: Q5.1(G) ; port LED3
LED4: Q1.1(G) ; port LED4
LED5: Q2.1(G) ; port LED5
USART2_RX: Q7.1(G) ; port USART2_RX
USART2_TX: Q6.1(G) ; port USART2_TX
NetD1O_A: D1O.A R10.1
NetD1O_K: D1O.K Q5.3(D)
NetD2_A: D2.A R12.1
NetD3_A: D3.A R11.1
NetD4_K: D4.K R13.1
NetD5_K: D5.K R14.1
NetD6_K: D6.K R16.1
NetD7_K: D7.K R15.1
NetD8_A: D8.A R7.1
NetD8_K: D8.K Q2.3(D)
NetD9_A: D9.A R6.1
NetD9_K: D9.K Q1.3(D)
NetD11_A: D11.A R9.1
NetD11_K: D11.K Q4.3(D)
NetD12_A: D12.A R8.1
NetD12_K: D12.K Q3.3(D)
NetQ6_3: Q6.3(D) R14.2
NetQ7_3: Q7.3(D) R13.2
NetQ8_3: Q8.3(D) R15.2
NetQ9_3: Q9.3(D) R16.2

### Notes on the sheet
- 60.15.0028
- PLACA IMPRESSA MONTADA DEVKIT IOT
- 030
- 00
- 60.15.0028_030_Rev00
- A2
- 09/09
- 1
- 2
- 3
- 4
- 5
- 6
- 7
- 8
- A
- B
- C
- D
- E
- F
- G
- H
- DOCUMENTO DE ENGENHARIA DE PRODUTO
- DOCUMENT OF PRODUCT ENGINEERING
- CÓDIGO / CODE
- DESCRIÇÃO / DESCRIPTION
- DOC
- REV
- ARQUIVO / FILE
- FORM./SIZE
- FOLHA / PAGE
- (in symbol 32.17.0022) VERDE
- (in symbol 72.19.0021) 2N7002
- (in symbol 72.19.0071) NX3008PBKMB

### Library data of the parts
D1O D2-D9 D11 D12 = 32.17.0022: LED VERDE SMD 20MA 5V
Q1-Q5 = 72.19.0021: TRANSISTOR MOSFET N 60V 115MA 0.2W SMD
Q6-Q9 = 72.19.0071: MOSFET CANAL P SMD 30V 230mA SOT883B
R6-R11 R13-R16 = 66.33.4700: RES MET 0,125W 470 OHMS 5% SMD 0805
R12 = 66.33.6800: RES MET 0,125W 680 OHMS 5% SMD 0805

## Sheet USB.SchDoc
size 594 x 420 mm; SheetNumber: 8; PageSetup: Record=PageOptions|CenterHorizontal=False|CenterVertical=False|PrintScale=0.43|XCorrection=0.00|YCorrection=0.00|PrintKind=1|BorderSize=5000000|LeftOffset=0|BottomOffset=0|Orientation=2|PaperLength=5940|PaperWidth=4200|Scale=100|PaperSource=7|PrintQuality=-4|MediaType=1|DitherType=10|PaperKind=Personal. 1: 215,9 x 279,4 mm|PrintScaleMode=0
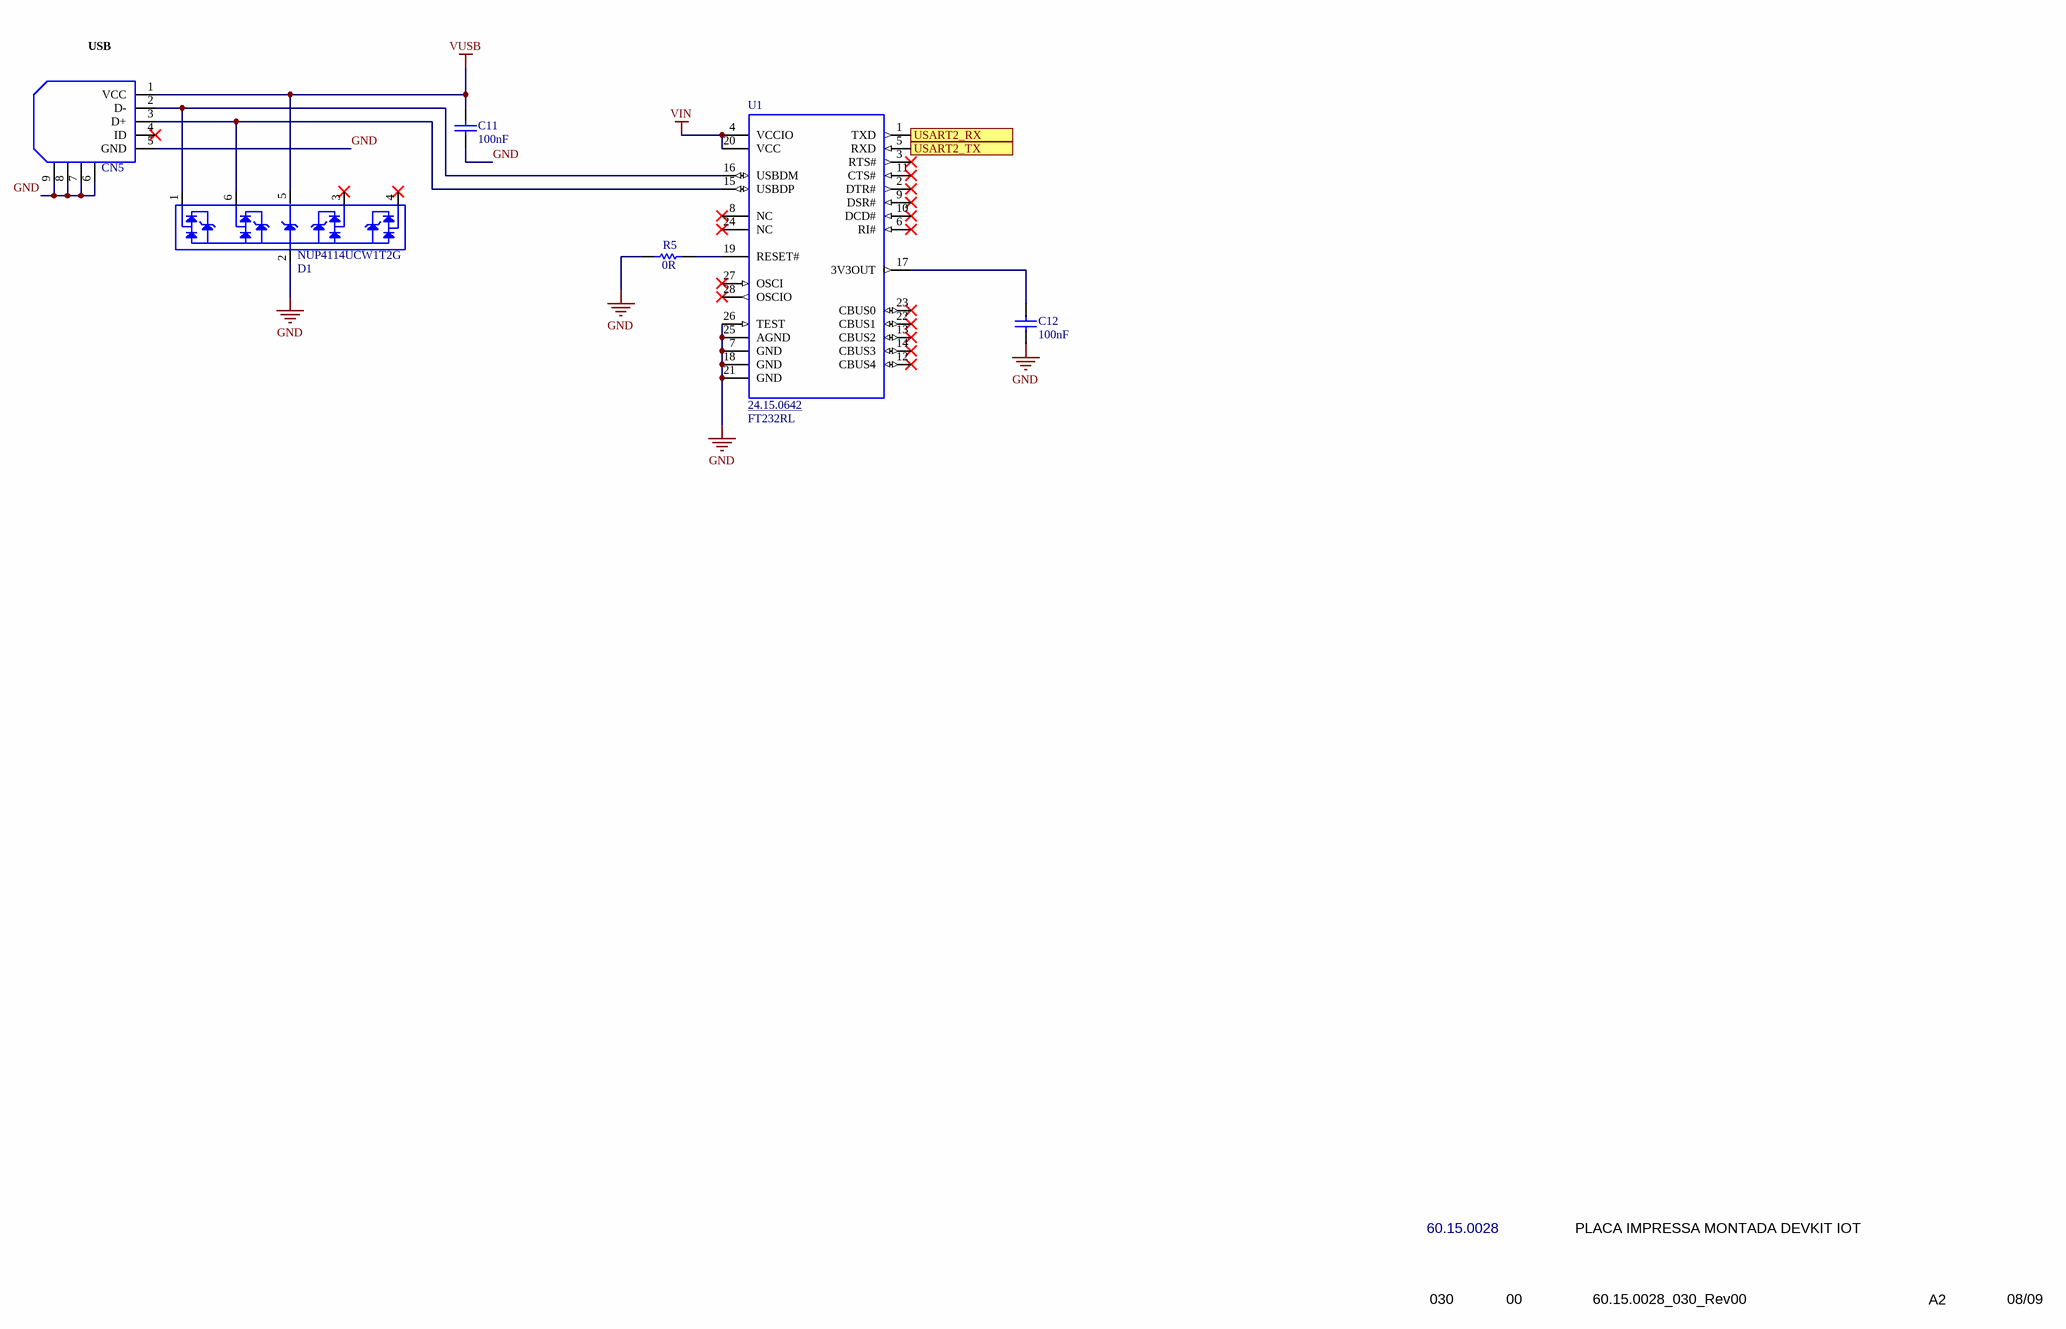
[diagram p5: USB.SchDoc]

### Parts
C11  16.23.0803  [16.23.0803]  (value not drawn)
C12  value 100nF  [16.23.0023]  (hidden comment: 16.23.0023)
CN5  28.14.0512  [28.14.0512]  (value not drawn)
D1  32.27.0043  [32.27.0043]  (value not drawn)
R5  value 0R  [66.24.1337]  (hidden comment: 66.24.1337)
U1  24.15.0642  Part Number: FT232RL  [24.15.0642]

### Ports
USART2_RX, USART2_TX

### Nets
GND: C11.1 C12.1 CN5.5(GND) CN5.6(SHIELD) CN5.7(SHIELD) CN5.8(SHIELD) CN5.9(SHIELD) D1.2 R5.1 U1.7(GND) U1.18(GND) U1.21(GND) U1.25(AGND) U1.26(TEST)
VIN: U1.4(VCCIO) U1.20(VCC)
VUSB: C11.2 CN5.1(VCC) D1.5
USART2_RX: U1.1(TXD) ; port USART2_RX
USART2_TX: U1.5(RXD) ; port USART2_TX
NetC12_2: C12.2 U1.17(3V3OUT)
NetCN5_2: CN5.2(D-) D1.1 U1.16(USBDM)
NetCN5_3: CN5.3(D+) D1.6 U1.15(USBDP)
NetR5_2: R5.2 U1.19(RESET#)

Not connected (* = marked no-connect by the designer): CN5 4(ID)*; D1 3* 4*; U1 2(DTR#)* 3(RTS#)* 6(RI#)* 8(NC)* 9(DSR#)* 10(DCD#)* 11(CTS#)* 12(CBUS4)* 13(CBUS2)* 14(CBUS3)* 22(CBUS1)* 23(CBUS0)* 24(NC)* 27(OSCI)* 28(OSCIO)*

### Notes on the sheet
- (near CN5) USB
- 60.15.0028
- PLACA IMPRESSA MONTADA DEVKIT IOT
- 030
- 00
- 60.15.0028_030_Rev00
- A2
- 08/09
- 1
- 2
- 3
- 4
- 5
- 6
- 7
- 8
- A
- B
- C
- D
- E
- F
- G
- H
- DOCUMENTO DE ENGENHARIA DE PRODUTO
- DOCUMENT OF PRODUCT ENGINEERING
- CÓDIGO / CODE
- DESCRIÇÃO / DESCRIPTION
- DOC
- REV
- ARQUIVO / FILE
- FORM./SIZE
- FOLHA / PAGE
- (in symbol 16.23.0803) 100nF
- (in symbol 32.27.0043) NUP4114UCW1T2G

### Library data of the parts
C11 = 16.23.0803: CAPACITOR CERAMICO 100nF 16V 10%% X5R SMD 0201
C12 = 16.23.0023: CC SMD 100NF 50V X7R 10% 0805
CN5 = 28.14.0512: CONN USB MICRO B RECPT SMT R/A; Value: 10118192-0001LF
D1 = 32.27.0043: DIODO SUPRESSOR 5.5V 10V SC88
R5 = 66.24.1337: RESISTOR THICK FILM 0,1W 0 OHMS SMD 0603
U1 = 24.15.0642: CID CONVERSOR USB PARA SERIAL SSOP-28; Manufactor: FTDI; Value: FT232RL

## Sheet EXS82_USB.SchDoc
size 594 x 420 mm; SheetNumber: 2; PageSetup: Record=PageOptions|CenterHorizontal=False|CenterVertical=False|PrintScale=0.43|XCorrection=0.00|YCorrection=0.00|PrintKind=1|BorderSize=5000000|LeftOffset=0|BottomOffset=0|Orientation=2|PaperLength=5940|PaperWidth=4200|Scale=100|PaperSource=7|PrintQuality=-4|MediaType=1|DitherType=10|PaperKind=Personal. 1: 215,9 x 279,4 mm|PrintScaleMode=0
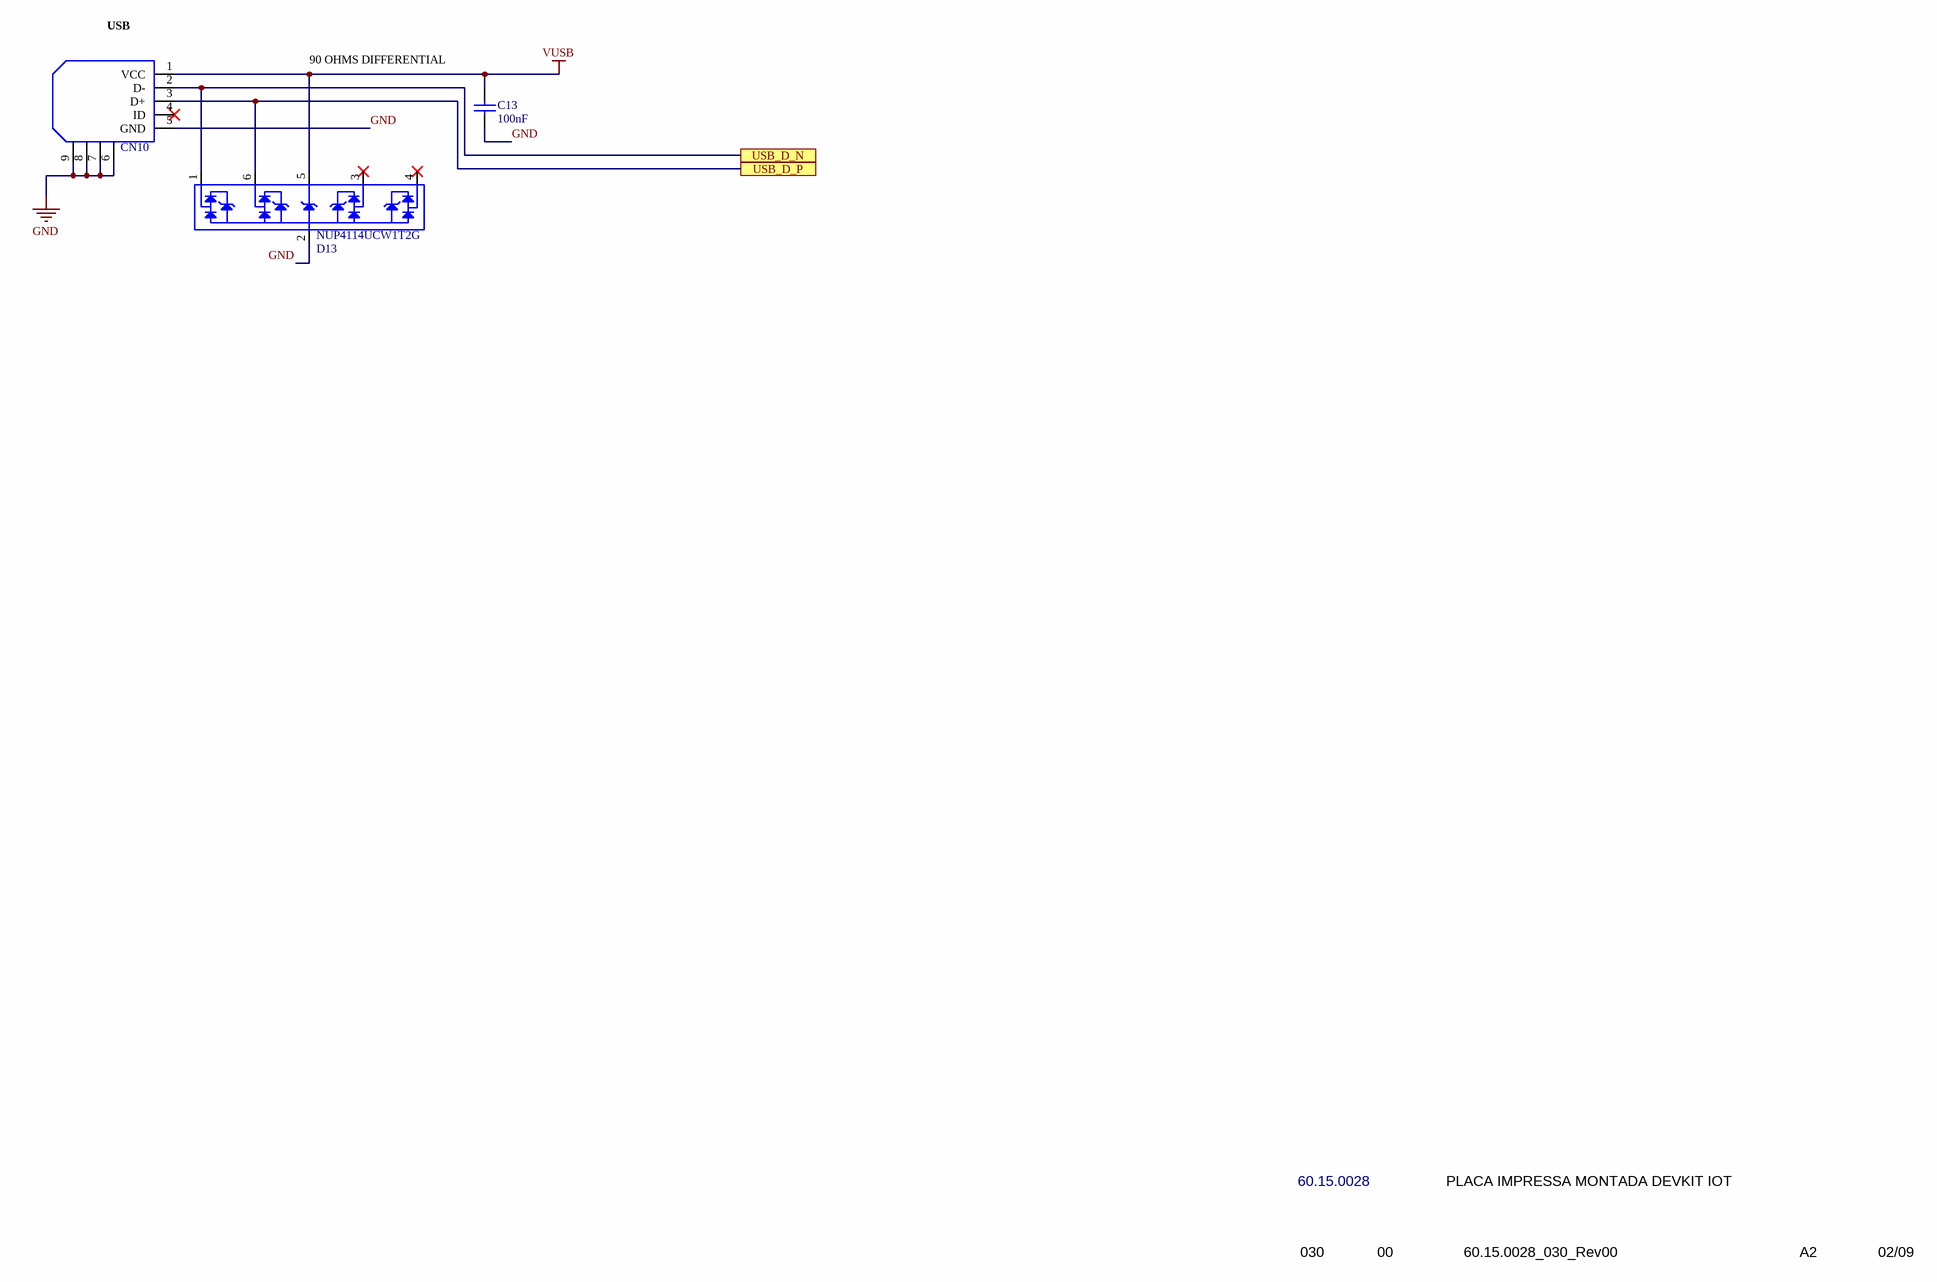
[diagram p6: EXS82_USB.SchDoc]

### Parts
C13  16.23.0803  [16.23.0803]  (value not drawn)
CN10  28.14.0512  [28.14.0512]  (value not drawn)
D13  32.27.0043  [32.27.0043]  (value not drawn)

### Ports
USB_D_N, USB_D_P

### Nets
GND: C13.1 CN10.5(GND) CN10.6(SHIELD) CN10.7(SHIELD) CN10.8(SHIELD) CN10.9(SHIELD) D13.2
VUSB: C13.2 CN10.1(VCC) D13.5
USB_D_N: CN10.2(D-) D13.1 ; port USB_D_N
USB_D_P: CN10.3(D+) D13.6 ; port USB_D_P

Not connected (* = marked no-connect by the designer): CN10 4(ID)*; D13 3* 4*

### Notes on the sheet
- (near CN10) USB
- 90 OHMS DIFFERENTIAL
- 60.15.0028
- PLACA IMPRESSA MONTADA DEVKIT IOT
- 030
- 00
- 60.15.0028_030_Rev00
- A2
- 02/09
- 1
- 2
- 3
- 4
- 5
- 6
- 7
- 8
- A
- B
- C
- D
- E
- F
- G
- H
- DOCUMENTO DE ENGENHARIA DE PRODUTO
- DOCUMENT OF PRODUCT ENGINEERING
- CÓDIGO / CODE
- DESCRIÇÃO / DESCRIPTION
- DOC
- REV
- ARQUIVO / FILE
- FORM./SIZE
- FOLHA / PAGE
- (in symbol 16.23.0803) 100nF
- (in symbol 32.27.0043) NUP4114UCW1T2G

### Library data of the parts
C13 = 16.23.0803: as C11 on sheet USB
CN10 = 28.14.0512: as CN5 on sheet USB
D13 = 32.27.0043: DIODO SUPRESSOR 5.5V 10V SC88

## Sheet Power Supply.SchDoc
size 594 x 420 mm; SheetNumber: 6; PageSetup: Record=PageOptions|CenterHorizontal=False|CenterVertical=False|PrintScale=1.00|XCorrection=0.00|YCorrection=0.00|PrintKind=1|BorderSize=5000000|LeftOffset=0|BottomOffset=0|Orientation=2|PaperLength=1000|PaperWidth=1000|Scale=100|PaperSource=7|PrintQuality=-4|MediaType=1|DitherType=10|PaperKind=A3 (297 x 420 mm)|PrintScaleMode=0
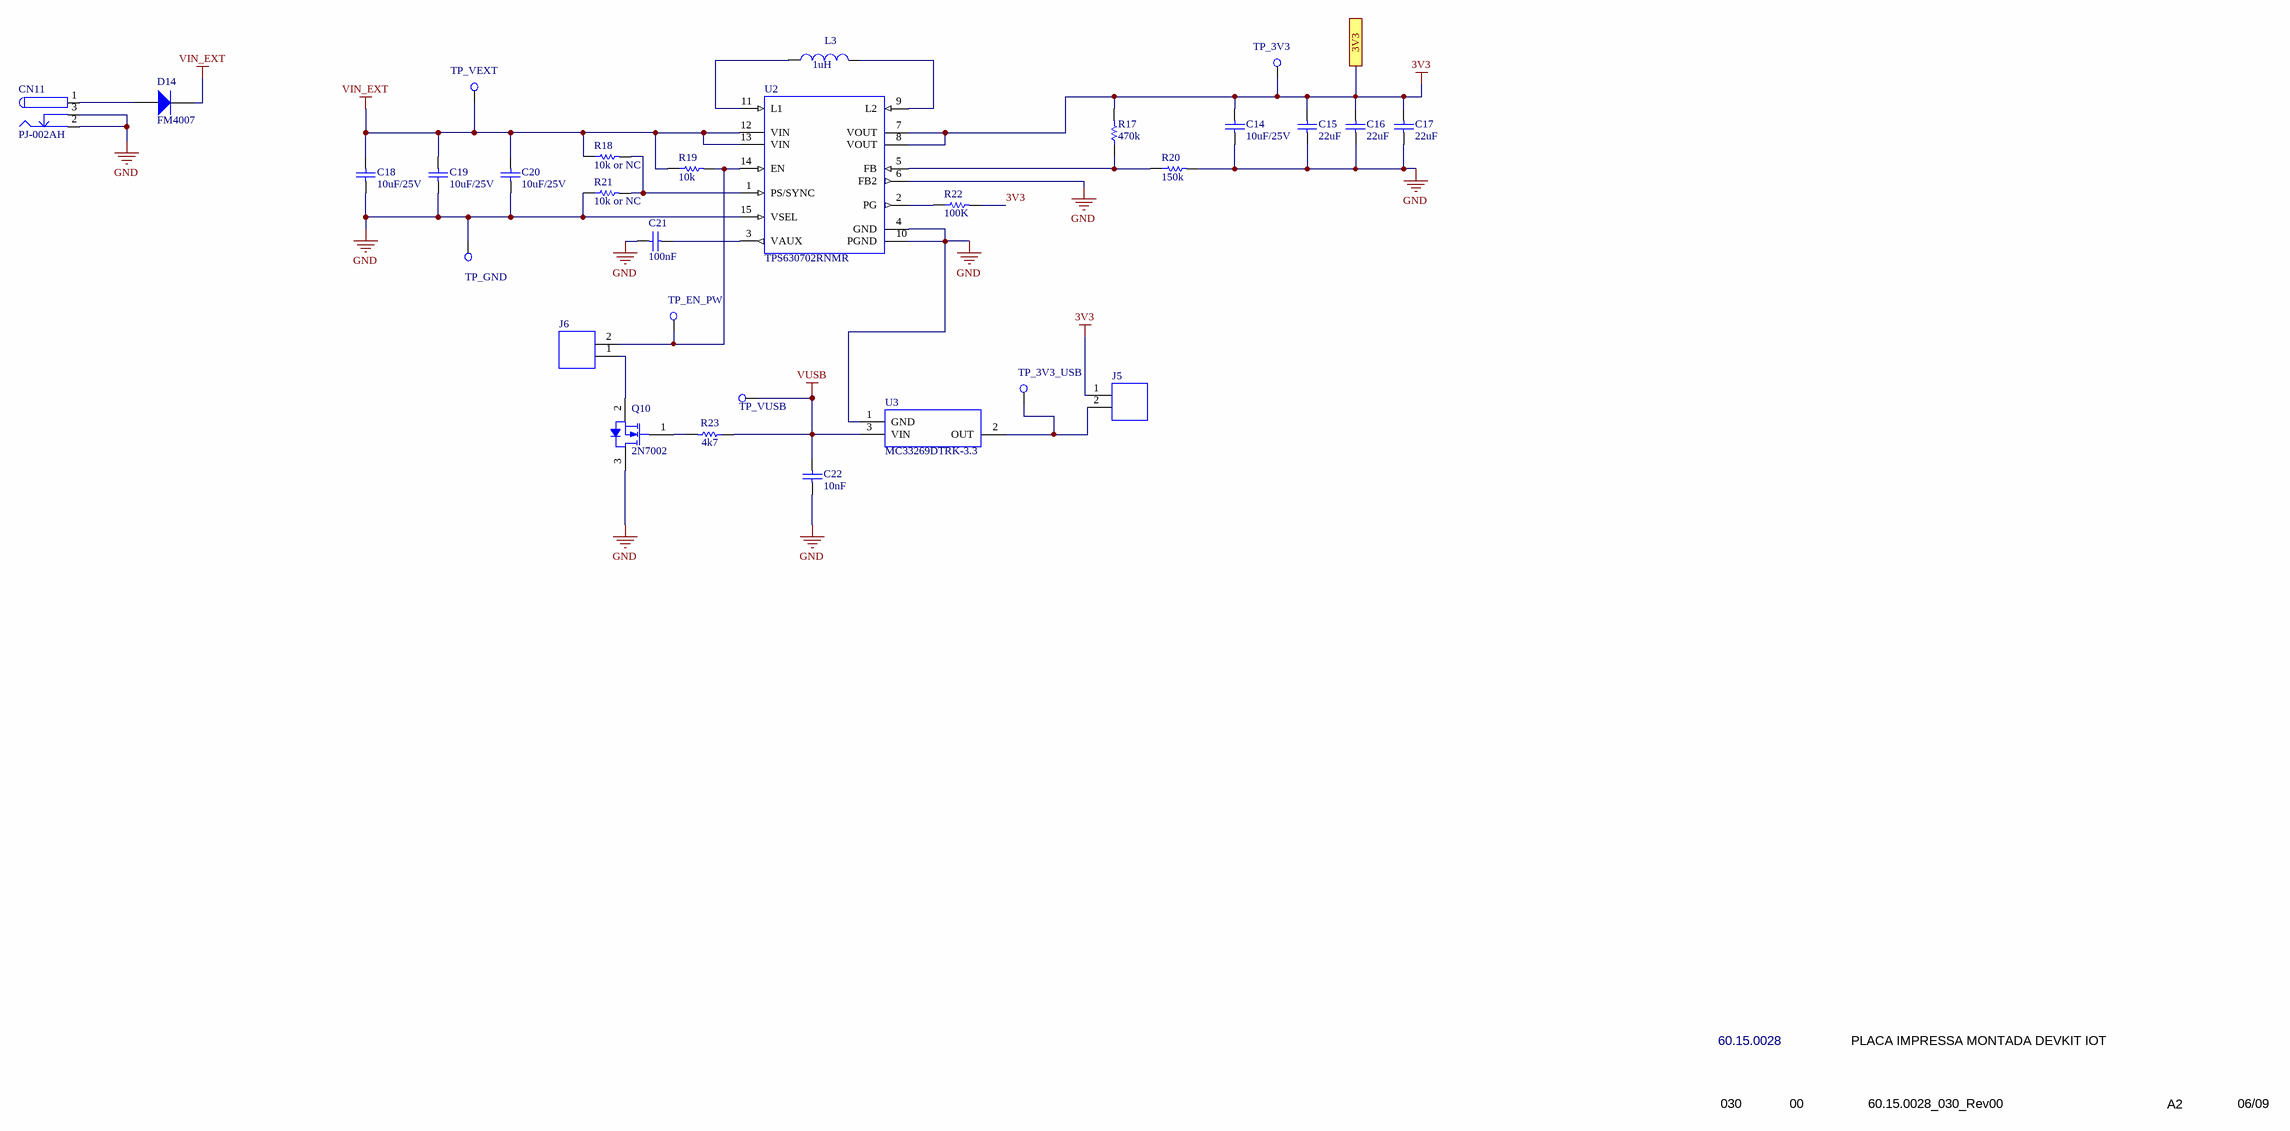
[diagram p7: Power Supply.SchDoc]

### Parts
C14  value 10uF/25V  [16.23.0733]  (hidden comment: 16.23.0733)
C15  16.23.0428  [16.23.0428]  (value not drawn)
C16  16.23.0428  [16.23.0428]  (value not drawn)
C17  16.23.0428  [16.23.0428]  (value not drawn)
C18  value 10uF/25V  [16.23.0735]  (hidden comment: 16.23.0735)
C19  value 10uF/25V  [16.23.0735]  (hidden comment: 16.23.0735)
C20  value 10uF/25V  [16.23.0733]  (hidden comment: 16.23.0733)
C21  value 100nF  [16.23.0807]  (hidden comment: 16.23.0807)
C22  16.23.0427  [16.23.0427]  (value not drawn)
CN11  CUI INC: PJ-002AH  [28.39.0015]  (hidden comment: 28.39.0015)
D14  value FM4007  [32.21.0028]  (hidden comment: 32.21.0028)
J5  70.11.0010  [70.11.0010]  (value not drawn)
J6  70.11.0010  [70.11.0010]  (value not drawn)
L3  value 1uH  [40.12.0346]  (hidden comment: 40.12.0346)
Q10  72.19.0021  [72.19.0021]  (value not drawn)
R17  value 470k  [66.21.1644]  (hidden comment: 66.21.1644)
R18  value 10k or NC  [66.21.1646]  (hidden comment: 66.21.1646)
R19  value 10k  [66.21.1646]  (hidden comment: 66.21.1646)
R20  value 150k  [66.21.1645]  (hidden comment: 66.21.1645)
R21  value 10k or NC  [66.21.1646]  (hidden comment: 66.21.1646)
R22  value 100K  [66.24.1346]  (hidden comment: 66.24.1346)
R23  value 4k7  [66.24.1353]  (hidden comment: 66.24.1353)
TP_3V3  TESTPOINT  [TESTPOINT-60MILS]  (value not drawn)
TP_3V3_USB  TESTPOINT  [TESTPOINT-60MILS]  (value not drawn)
TP_EN_PW  TESTPOINT  [TESTPOINT-60MILS]  (value not drawn)
TP_GND  TESTPOINT  [TESTPOINT-60MILS]  (value not drawn)
TP_VEXT  TESTPOINT  [TESTPOINT-60MILS]  (value not drawn)
TP_VUSB  TESTPOINT  [TESTPOINT-60MILS]  (value not drawn)
U2  value TPS630702RNMR  [26.24.0200]  (hidden comment: 26.24.0200)
U3  value MC33269DTRK-3.3  [26.24.0067]  (hidden comment: 26.24.0067)

### Ports
3V3

### Nets
3V3: C14.2 C15.2 C16.2 C17.2 J5.1 R17.2 R22.2 TP_3V3.1(TP) U2.7(VOUT) U2.8(VOUT) ; port 3V3
GND: C14.1 C15.1 C16.1 C17.1 C18.1 C19.1 C20.1 C21.1 C22.2 CN11.2 CN11.3 Q10.3(D) R20.2 R21.1 TP_GND.1(TP) U2.4(GND) U2.6(FB2) U2.10(PGND) U2.15(VSEL) U3.1(GND)
VIN_EXT: C18.2 C19.2 C20.2 D14.K R18.1 R19.1 TP_VEXT.1(TP) U2.12(VIN) U2.13(VIN)
VUSB: C22.1 R23.1 TP_VUSB.1(TP) U3.3(VIN)
NetC21_2: C21.2 U2.3(VAUX)
NetCN11_1: CN11.1 D14.A
NetJ5_2: J5.2 TP_3V3_USB.1(TP) U3.2(OUT)
NetJ6_1: J6.1 Q10.2(S)
NetJ6_2: J6.2 R19.2 TP_EN_PW.1(TP) U2.14(EN)
NetL3_1: L3.1 U2.11(L1)
NetL3_2: L3.2 U2.9(L2)
NetQ10_1: Q10.1(G) R23.2
NetR17_1: R17.1 R20.1 U2.5(FB)
NetR18_2: R18.2 R21.2 U2.1(PS/SYNC)
NetR22_1: R22.1 U2.2(PG)

### Notes on the sheet
- 60.15.0028
- PLACA IMPRESSA MONTADA DEVKIT IOT
- 030
- 00
- 60.15.0028_030_Rev00
- A2
- 06/09
- 1
- 2
- 3
- 4
- 5
- 6
- 7
- 8
- A
- B
- C
- D
- E
- F
- G
- H
- DOCUMENTO DE ENGENHARIA DE PRODUTO
- DOCUMENT OF PRODUCT ENGINEERING
- CÓDIGO / CODE
- DESCRIÇÃO / DESCRIPTION
- DOC
- REV
- ARQUIVO / FILE
- FORM./SIZE
- FOLHA / PAGE
- (in symbol 16.23.0427) 10nF
- (in symbol 16.23.0428) 22uF
- (in symbol 72.19.0021) 2N7002

### Library data of the parts
C14 C20 = 16.23.0733: CAPACITOR CERAMICO MULTICAMADAS 10uF 25V 20% SMD 0603 X5R; Part Number: GRM188R61E106MA73; Fabricante: Murata
C15-C17 = 16.23.0428: CC MUL 22uF 16V X5R 20% SMD 0805
C18 C19 = 16.23.0735: CAPACITOR CERAMICO MULTICAMADAS 10uF 25V 10% SMD 0805 X5R; Part Number: GRM21BR61E106KA73; Fabricante: Murata
C21 = 16.23.0807: CAPACITOR CERAMICO MULTICAMADAS 100nF 50V X7R 10% SMD 0402
C22 = 16.23.0427: CC MUL 10nF 16V C0G 10%  SMD 0402
CN11 = 28.39.0015: CONECTOR ALIMENTACAO JACK  MODEL PJ-002AH - SMT -TR
D14 = 32.21.0028: DIODO RETIFICADOR 1A 1000V 1N4007 SMD DO-214AC; Parameter 1: RECTRON; Part Number: FM4007
J5 J6 = 70.11.0010: BARRA DE TERMINAIS 1x2
L3 = 40.12.0346: INDUTOR FIXO 1uH 20% 5A 36mOHM SMD 1008
Q10 = 72.19.0021: TRANSISTOR MOSFET N 60V 115MA 0.2W SMD
R17 = 66.21.1644: RESISTOR THICK FILM 470k OHMS 25V 0.05W 1% SMD 0201
R18 R19 R21 = 66.21.1646: RESISTOR THICK FILM 10k OHMS 25V 0.05W 1% SMD 0201
R20 = 66.21.1645: RESISTOR THICK FILM 150k OHMS 25V 0.05W 1% SMD 0201
R22 = 66.24.1346: RESISTOR THICK FILM 50mW 100K OHMS 1% SMD 0201
R23 = 66.24.1353: RESISTOR THICK FILM 4k7 kOHMS 50V 0,1W 1% SMD 0402; Manufactor: PANASONIC; Part Number: ERJ-2RKF4701X
TP_3V3 TP_3V3_USB TP_EN_PW TP_GND TP_VEXT TP_VUSB = TESTPOINT-60MILS: PONTO DE TESTE PARA CAMA DE PREGO
U2 = 26.24.0200: CI REGULADOR TENSAO CHAV AJUST 2A16V 2A DESC SAIDA VQFN-HR
U3 = 26.24.0067: CIL REGULADOR DE TENSAO 3.3V SMD

## Sheet Interfaces.SchDoc
size 594 x 420 mm; SheetNumber: 5; PageSetup: Record=PageOptions|CenterHorizontal=False|CenterVertical=False|PrintScale=0.43|XCorrection=0.00|YCorrection=0.00|PrintKind=1|BorderSize=5000000|LeftOffset=0|BottomOffset=0|Orientation=2|PaperLength=5940|PaperWidth=4200|Scale=100|PaperSource=7|PrintQuality=-4|MediaType=1|DitherType=10|PaperKind=Personal. 1: 215,9 x 279,4 mm|PrintScaleMode=0
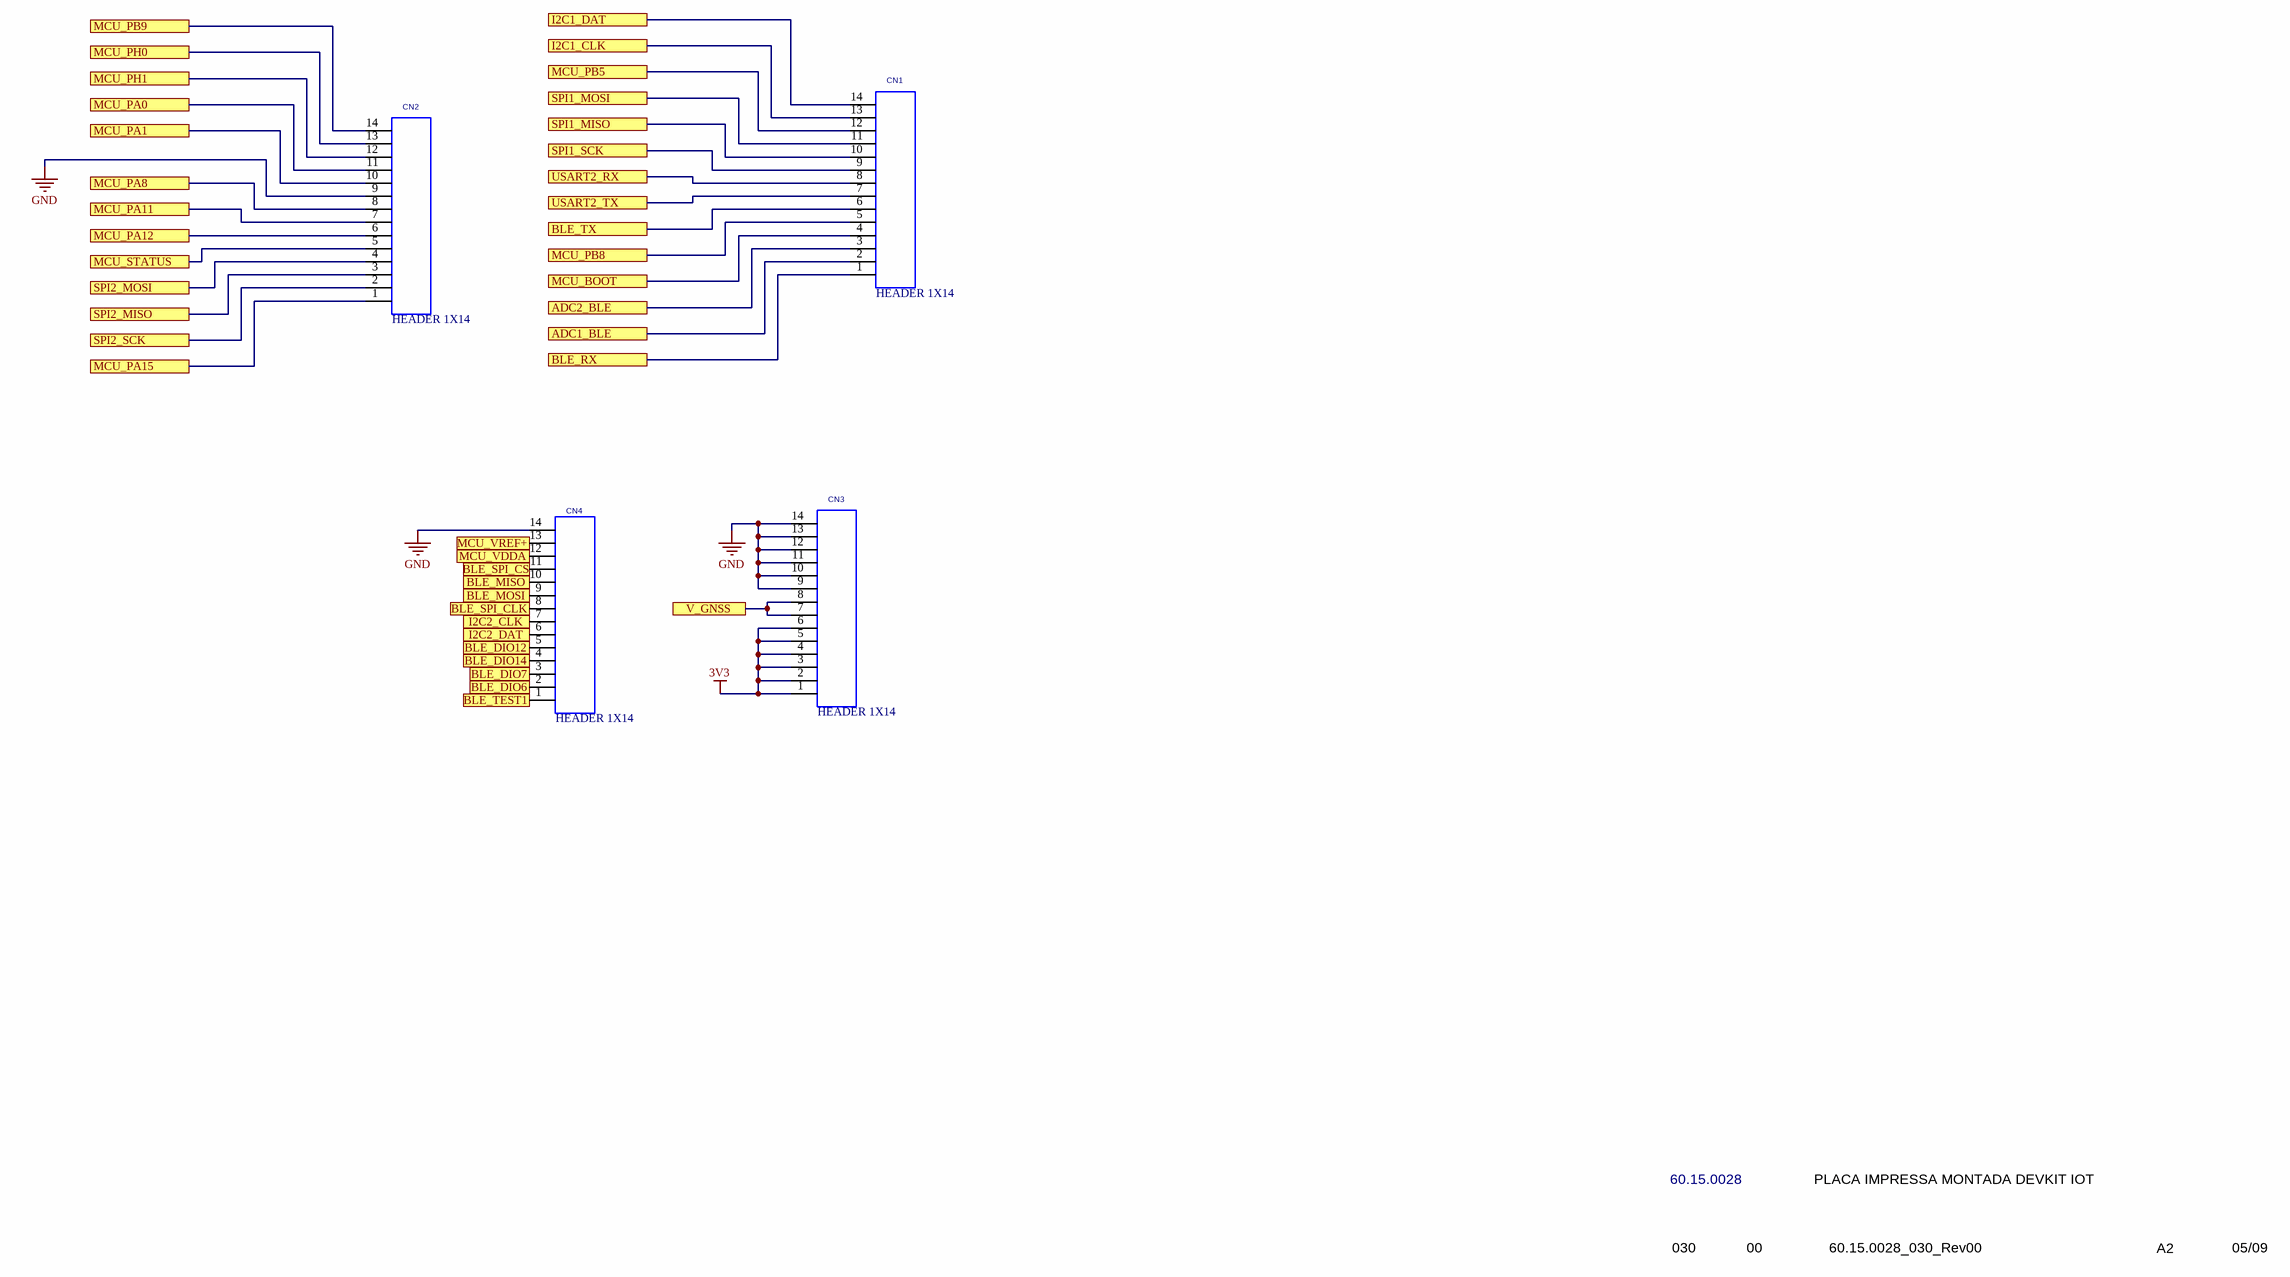
[diagram p8: Interfaces.SchDoc]

### Parts
CN1  28.14.0551  [28.14.0551]  (value not drawn)
CN2  28.14.0551  [28.14.0551]  (value not drawn)
CN3  28.14.0551  [28.14.0551]  (value not drawn)
CN4  28.14.0551  [28.14.0551]  (value not drawn)

### Ports
ADC1_BLE, ADC2_BLE, BLE_DIO6, BLE_DIO7, BLE_DIO12, BLE_DIO14, BLE_MISO, BLE_MOSI, BLE_RX, BLE_SPI_CLK, BLE_SPI_CS, BLE_TEST1, BLE_TX, I2C1_CLK, I2C1_DAT, I2C2_CLK, I2C2_DAT, MCU_BOOT, MCU_PA0, MCU_PA1, MCU_PA8, MCU_PA11, MCU_PA12, MCU_PA15, MCU_PB5, MCU_PB8, MCU_PB9, MCU_PH0, MCU_PH1, MCU_STATUS, MCU_VDDA, MCU_VREF+, SPI1_MISO, SPI1_MOSI, SPI1_SCK, SPI2_MISO, SPI2_MOSI, SPI2_SCK, USART2_RX, USART2_TX, V_GNSS

### Nets
3V3: CN3.1 CN3.2 CN3.3 CN3.4 CN3.5 CN3.6
GND: CN2.9 CN3.9 CN3.10 CN3.11 CN3.12 CN3.13 CN3.14 CN4.14
ADC1_BLE: CN1.2 ; port ADC1_BLE
ADC2_BLE: CN1.3 ; port ADC2_BLE
BLE_DIO6: CN4.2 ; port BLE_DIO6
BLE_DIO7: CN4.3 ; port BLE_DIO7
BLE_DIO12: CN4.5 ; port BLE_DIO12
BLE_DIO14: CN4.4 ; port BLE_DIO14
BLE_MISO: CN4.9 ; port BLE_MOSI
BLE_MOSI: CN4.10 ; port BLE_MISO
BLE_RX: CN1.1 ; port BLE_RX
BLE_SPI_CLK: CN4.8 ; port BLE_SPI_CLK
BLE_SPI_CS: CN4.11 ; port BLE_SPI_CS
BLE_TEST1: CN4.1 ; port BLE_TEST1
BLE_TX: CN1.6 ; port BLE_TX
I2C1_CLK: CN1.13 ; port I2C1_CLK
I2C1_DAT: CN1.14 ; port I2C1_DAT
I2C2_CLK: CN4.7 ; port I2C2_CLK
I2C2_DAT: CN4.6 ; port I2C2_DAT
LED1: CN2.11 ; port MCU_PA0
LED2: CN2.10 ; port MCU_PA1
LED3: CN2.8 ; port MCU_PA8
LED4: CN2.7 ; port MCU_PA11
LED5: CN2.6 ; port MCU_PA12
MCU_BOOT: CN1.4 ; port MCU_BOOT
MCU_PA15: CN2.1 ; port MCU_PA15
MCU_PB5: CN1.12 ; port MCU_PB5
MCU_PB8: CN1.5 ; port MCU_PB8
MCU_PB9: CN2.14 ; port MCU_PB9
MCU_PH0: CN2.13 ; port MCU_PH0
MCU_PH1: CN2.12 ; port MCU_PH1
MCU_STATUS: CN2.5 ; port MCU_STATUS
MCU_VDDA: CN4.12 ; port MCU_VDDA
MCU_VREF+: CN4.13 ; port MCU_VREF+
SPI1_MISO: CN1.10 ; port SPI1_MISO
SPI1_MOSI: CN1.11 ; port SPI1_MOSI
SPI1_SCK: CN1.9 ; port SPI1_SCK
SPI2_MISO: CN2.3 ; port SPI2_MISO
SPI2_MOSI: CN2.4 ; port SPI2_MOSI
SPI2_SCK: CN2.2 ; port SPI2_SCK
USART2_RX: CN1.8 ; port USART2_RX
USART2_TX: CN1.7 ; port USART2_TX
V_GNSS: CN3.7 CN3.8 ; port V_GNSS

### Notes on the sheet
- 60.15.0028
- PLACA IMPRESSA MONTADA DEVKIT IOT
- 030
- 00
- 60.15.0028_030_Rev00
- A2
- 05/09
- 1
- 2
- 3
- 4
- 5
- 6
- 7
- 8
- A
- B
- C
- D
- E
- F
- G
- H
- DOCUMENTO DE ENGENHARIA DE PRODUTO
- DOCUMENT OF PRODUCT ENGINEERING
- CÓDIGO / CODE
- DESCRIÇÃO / DESCRIPTION
- DOC
- REV
- ARQUIVO / FILE
- FORM./SIZE
- FOLHA / PAGE
- (in symbol 28.14.0551) HEADER 1X14

### Library data of the parts
CN1-CN4 = 28.14.0551: CONECTOR HEADER FM 14 VIAS 180G P/PCB

## Sheet BLE.SchDoc
size 594 x 420 mm; SheetNumber: 7; PageSetup: Record=PageOptions|CenterHorizontal=False|CenterVertical=False|PrintScale=0.43|XCorrection=0.00|YCorrection=0.00|PrintKind=1|BorderSize=5000000|LeftOffset=0|BottomOffset=0|Orientation=2|PaperLength=5940|PaperWidth=4200|Scale=100|PaperSource=7|PrintQuality=-4|MediaType=1|DitherType=10|PaperKind=Personal. 1: 215,9 x 279,4 mm|PrintScaleMode=0
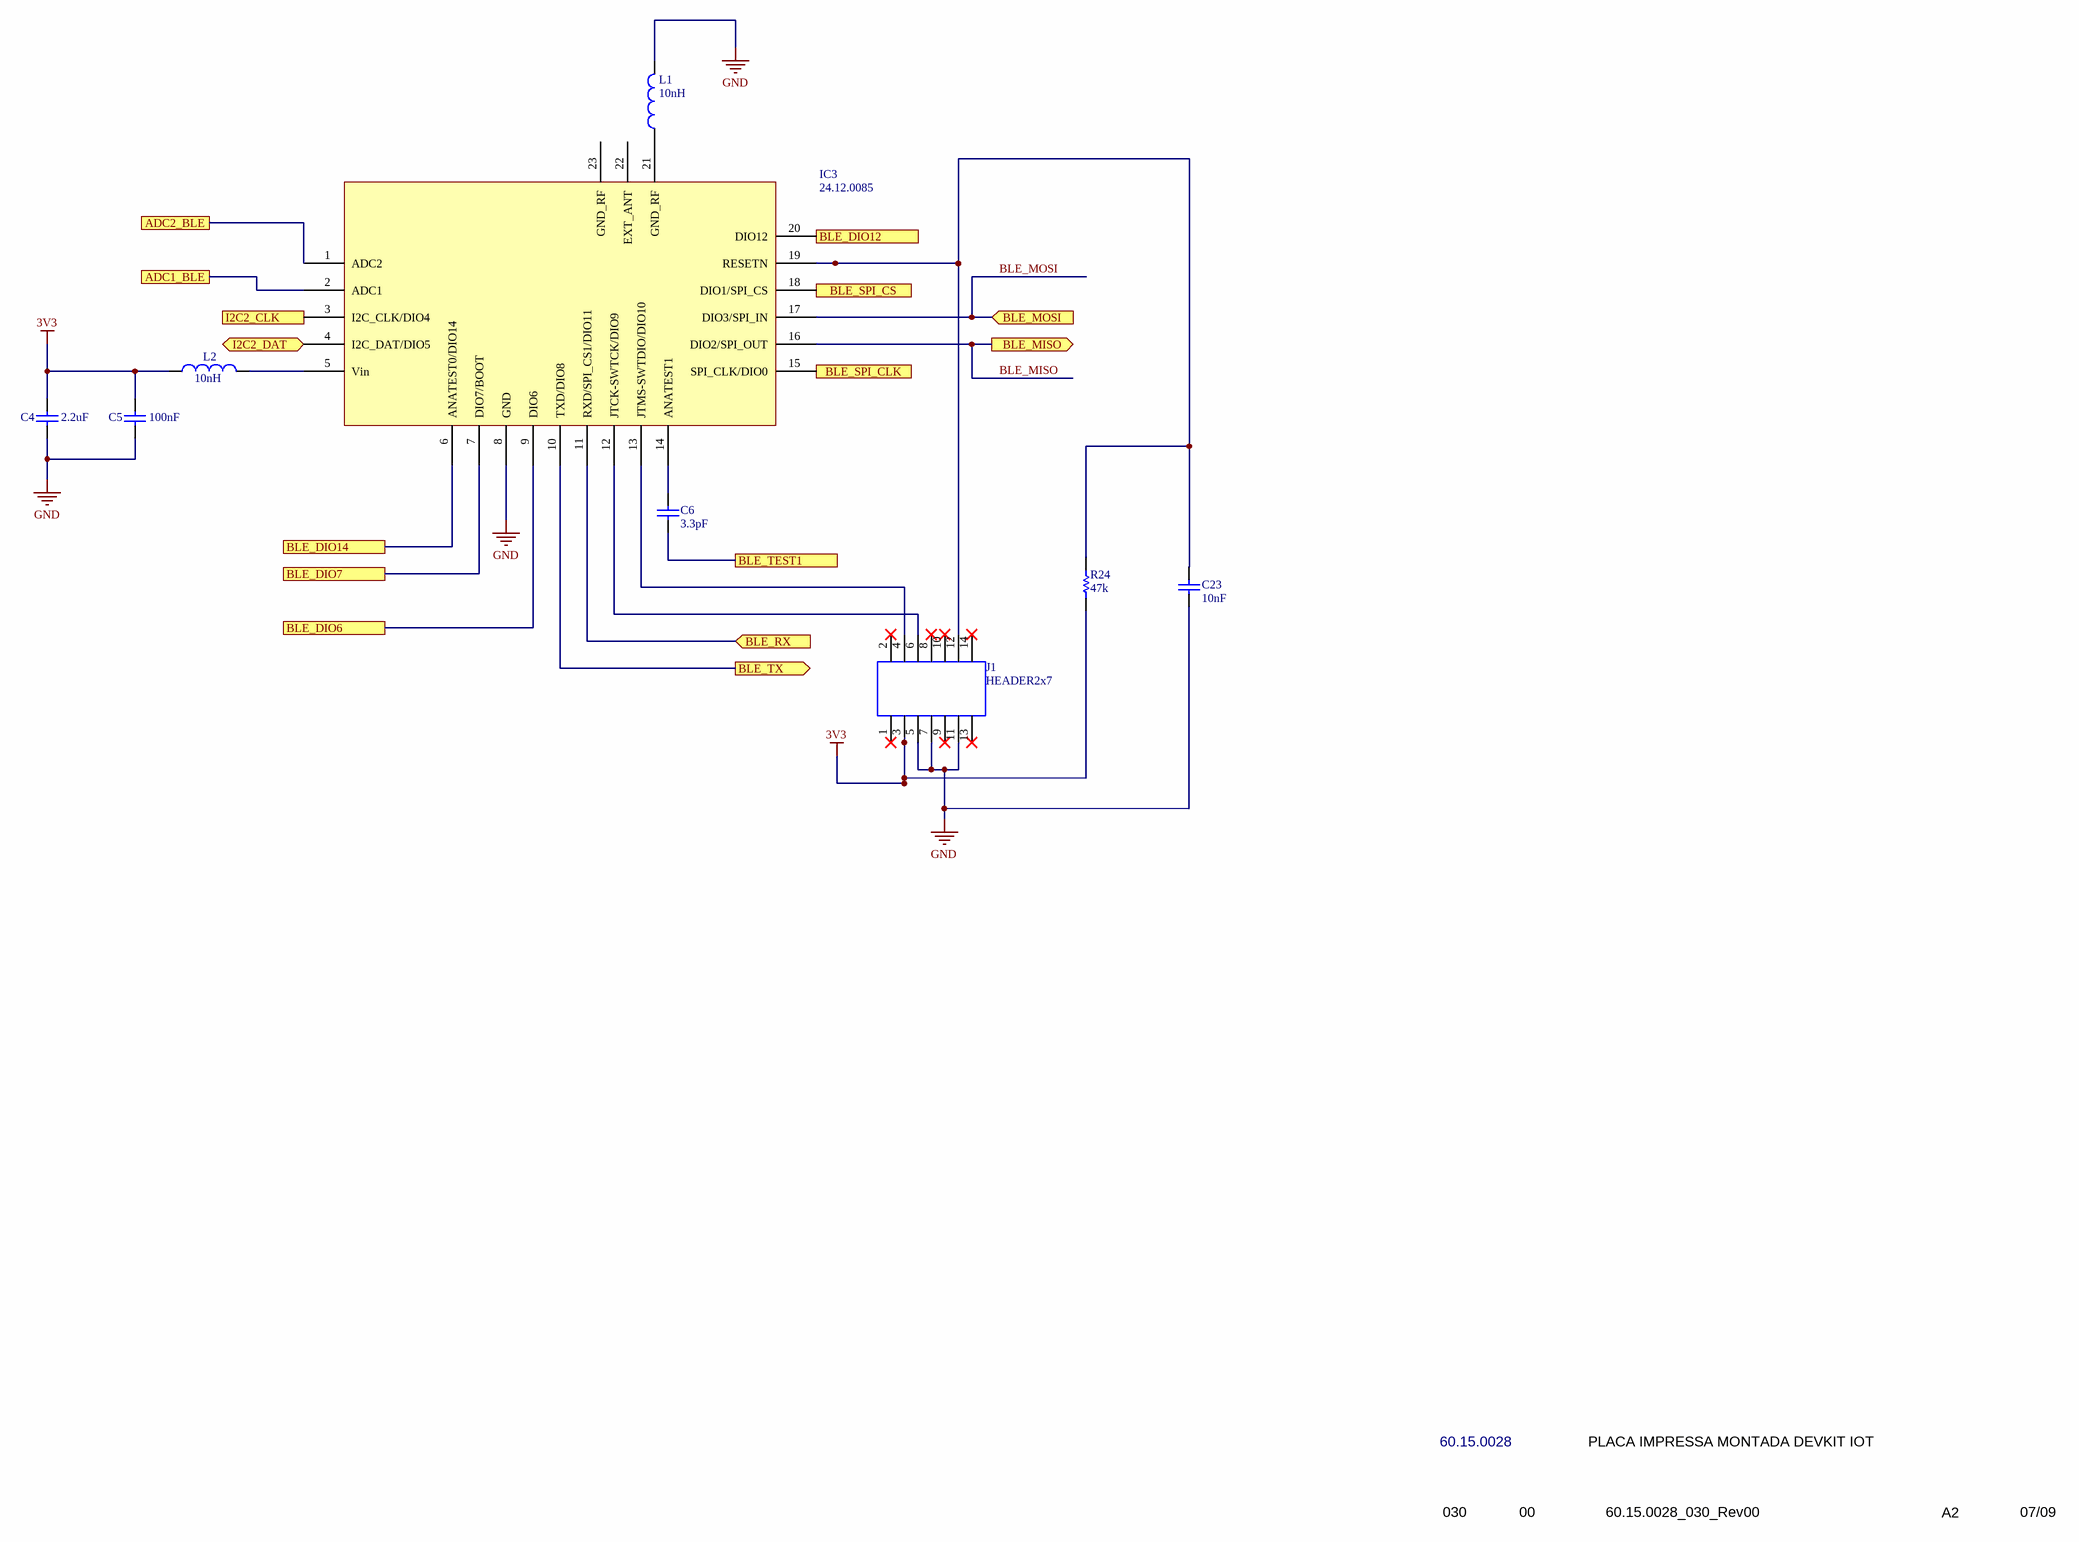
[diagram p9: BLE.SchDoc]

### Parts
C4  16.23.0334  [16.23.0334]  (value not drawn)
C5  value 100nF  [16.23.0278]  (hidden comment: 16.23.0278)
C6  16.23.0156  [16.23.0156]  (value not drawn)
C23  Adicionado  [0201]  (value not drawn)
IC3  24.12.0085  [24.12.0085]
J1  value HEADER2x7  [70.11.0077]  (hidden comment: 70.11.0077)
L1  value 10nH  [40.12.0348]  (hidden comment: 40.12.0348)
L2  value 10nH  [40.12.0348]  (hidden comment: 40.12.0348)
R24  value 47k  [0201]  (hidden comment: Adicionado)

### Ports
ADC1_BLE, ADC2_BLE, BLE_DIO6, BLE_DIO7, BLE_DIO12, BLE_DIO14, BLE_MISO (out), BLE_MOSI (in), BLE_RX (in), BLE_SPI_CLK (in), BLE_SPI_CS (in), BLE_TEST1, BLE_TX (out), I2C2_CLK (in), I2C2_DAT (bidir)

### Nets
3V3: C4.2 C5.2 J1.3 L2.1 R24.1
GND: C4.1 C5.1 C23.1 IC3.8(GND) J1.5 J1.7 J1.11 L1.2
ADC1_BLE: IC3.2(ADC1) ; port ADC1_BLE
ADC2_BLE: IC3.1(ADC2) ; port ADC2_BLE
BLE_DIO6: IC3.9(DIO6) ; port BLE_DIO6
BLE_DIO7: IC3.7(DIO7/BOOT) ; port BLE_DIO7
BLE_DIO12: IC3.20(DIO12) ; port BLE_DIO12
BLE_DIO14: IC3.6(ANATEST0/DIO14) ; port BLE_DIO14
BLE_MISO: IC3.16(DIO2/SPI_OUT) ; port BLE_MISO
BLE_MOSI: IC3.17(DIO3/SPI_IN) ; port BLE_MOSI
BLE_RX: IC3.11(RXD/SPI_CS1/DIO11) ; port BLE_RX
BLE_SPI_CLK: IC3.15(SPI_CLK/DIO0) ; port BLE_SPI_CLK
BLE_SPI_CS: IC3.18(DIO1/SPI_CS) ; port BLE_SPI_CS
BLE_TEST1: C6.1 ; port BLE_TEST1
BLE_TX: IC3.10(TXD/DIO8) ; port BLE_TX
I2C2_CLK: IC3.3(I2C_CLK/DIO4) ; port I2C2_CLK
I2C2_DAT: IC3.4(I2C_DAT/DIO5) ; port I2C2_DAT
NetC6_2: C6.2 IC3.14(ANATEST1)
NetC23_2: C23.2 IC3.19(RESETN) J1.12 R24.2
NetIC3_5: IC3.5(Vin) L2.2
NetIC3_12: IC3.12(JTCK-SWTCK/DIO9) J1.6
NetIC3_13: IC3.13(JTMS-SWTDIO/DIO10) J1.4
NetIC3_21: IC3.21(GND_RF) L1.1

Not connected (* = marked no-connect by the designer): IC3 22(EXT_ANT) 23(GND_RF); J1 1* 2* 8* 9* 10* 13* 14*

### Notes on the sheet
- 60.15.0028
- PLACA IMPRESSA MONTADA DEVKIT IOT
- 030
- 00
- 60.15.0028_030_Rev00
- A2
- 07/09
- 1
- 2
- 3
- 4
- 5
- 6
- 7
- 8
- A
- B
- C
- D
- E
- F
- G
- H
- DOCUMENTO DE ENGENHARIA DE PRODUTO
- DOCUMENT OF PRODUCT ENGINEERING
- CÓDIGO / CODE
- DESCRIÇÃO / DESCRIPTION
- DOC
- REV
- ARQUIVO / FILE
- FORM./SIZE
- FOLHA / PAGE
- (in symbol 16.23.0156) 3.3pF
- (in symbol 16.23.0334) 2.2uF
- (in symbol 02013D103KAT2A) 10nF

### Library data of the parts
C4 = 16.23.0334: CC 2.2UF 6.3V X5R 0402 SMD
C5 = 16.23.0278: CC X7R 100NF 16V 10% SMD 0603
C6 = 16.23.0156: CC SMD 3,3PF 50V 5% 0603
C23 = 02013D103KAT2A: CAPACITOR CERAMICO 10nF 25V 10% C0G SMD 0201
IC3 = 24.12.0085: CI MODULO DE COMUNICACAO BLUETOOTH DE BAIXO CONSUMO
J1 = 70.11.0077: as J3 on sheet Main
L1 L2 = 40.12.0348: INDUTOR FIXO 10nH 3% 500mA 260mOHM 0402; Manufactor: MURATA; Part Number: LQG15HS10NH02D
R24 = CRCW020147K0FNED: RESISTOR THICK FILM 47k OHMS 30V 50mW 1% SMD 0201

## Nets that join several sheets
3V3: Main (J3.3 J4.2 R25.1), Sensors (11 pins), LEDs (10 pins), Power Supply (10 pins), Interfaces (6 pins), BLE (5 pins)
GND: Main (9 pins), Antennas (10 pins), Sensors (11 pins), LEDs (11 pins), USB (14 pins), EXS82_USB (7 pins), Power Supply (20 pins), Interfaces (8 pins), BLE (8 pins)
SCL_Sensor: Main (CN7.5), Sensors (IC1.9 IC2.4 R2.2)
SDA_Sensor: Main (CN7.6), Sensors (IC1.11 IC2.3 R1.2)
VUSB: Main (CN8.10), LEDs (R12.2), USB (C11.2 CN5.1 D1.5), EXS82_USB (C13.2 CN10.1 D13.5), Power Supply (C22.1 R23.1 TP_VUSB.1 U3.3)
ADC1_BLE: Interfaces (CN1.2), BLE (IC3.2)
ADC2_BLE: Interfaces (CN1.3), BLE (IC3.1)
BLE_DIO6: Interfaces (CN4.2), BLE (IC3.9)
BLE_DIO7: Interfaces (CN4.3), BLE (IC3.7)
BLE_DIO12: Interfaces (CN4.5), BLE (IC3.20)
BLE_DIO14: Interfaces (CN4.4), BLE (IC3.6)
BLE_MISO: Interfaces (CN4.9), BLE (IC3.16)
BLE_MOSI: Interfaces (CN4.10), BLE (IC3.17)
BLE_RX: Main (CN6.7), LEDs (Q8.1), Interfaces (CN1.1), BLE (IC3.11)
BLE_SPI_CLK: Interfaces (CN4.8), BLE (IC3.15)
BLE_SPI_CS: Interfaces (CN4.11), BLE (IC3.18)
BLE_TEST1: Interfaces (CN4.1), BLE (C6.1)
BLE_TX: Main (CN6.6), LEDs (Q9.1), Interfaces (CN1.6), BLE (IC3.10)
I2C1_CLK: Main (CN6.9), Interfaces (CN1.13)
I2C1_DAT: Main (CN6.8), Interfaces (CN1.14)
I2C2_CLK: Interfaces (CN4.7), BLE (IC3.3)
I2C2_DAT: Interfaces (CN4.6), BLE (IC3.4)
LED1: Main (CN8.6), LEDs (Q3.1), Interfaces (CN2.11)
LED2: Main (CN8.7), LEDs (Q4.1), Interfaces (CN2.10)
LED3: Main (CN8.5), LEDs (Q5.1), Interfaces (CN2.8)
LED4: Main (CN8.4), LEDs (Q1.1), Interfaces (CN2.7)
LED5: Main (CN8.3), LEDs (Q2.1), Interfaces (CN2.6)
MCU_BOOT: Main (CN6.4), Interfaces (CN1.4)
MCU_PA15: Main (CN7.4), Interfaces (CN2.1)
MCU_PB5: Main (CN7.7), Interfaces (CN1.12)
MCU_PB8: Main (CN6.3), Interfaces (CN1.5)
MCU_PB9: Main (CN6.2), Interfaces (CN2.14)
MCU_PH0: Main (CN9.5), Interfaces (CN2.13)
MCU_PH1: Main (CN9.6), Interfaces (CN2.12)
MCU_STATUS: Main (CN9.9), Interfaces (CN2.5)
MCU_VDDA: Main (CN9.4), Interfaces (CN4.12)
MCU_VREF+: Main (CN9.3), Interfaces (CN4.13)
SPI1_MISO: Main (CN7.9), Interfaces (CN1.10)
SPI1_MOSI: Main (CN7.8), Interfaces (CN1.11)
SPI1_SCK: Main (CN7.10), Interfaces (CN1.9)
SPI2_MISO: Main (CN7.2), Interfaces (CN2.3)
SPI2_MOSI: Main (CN7.1), Interfaces (CN2.4)
SPI2_SCK: Main (CN7.3), Interfaces (CN2.2)
USART2_RX: Main (CN9.8), LEDs (Q7.1), USB (U1.1), Interfaces (CN1.8)
USART2_TX: Main (CN9.7), LEDs (Q6.1), USB (U1.5), Interfaces (CN1.7)
USB_D_N: Main (CN8.8), EXS82_USB (CN10.2 D13.1)
USB_D_P: Main (CN8.9), EXS82_USB (CN10.3 D13.6)
V_GNSS: Main (CN8.2), Interfaces (CN3.7 CN3.8)